# EAGLE board LinkIt ONE_v1.0 (EAGLE 6.4), part 1 of 3
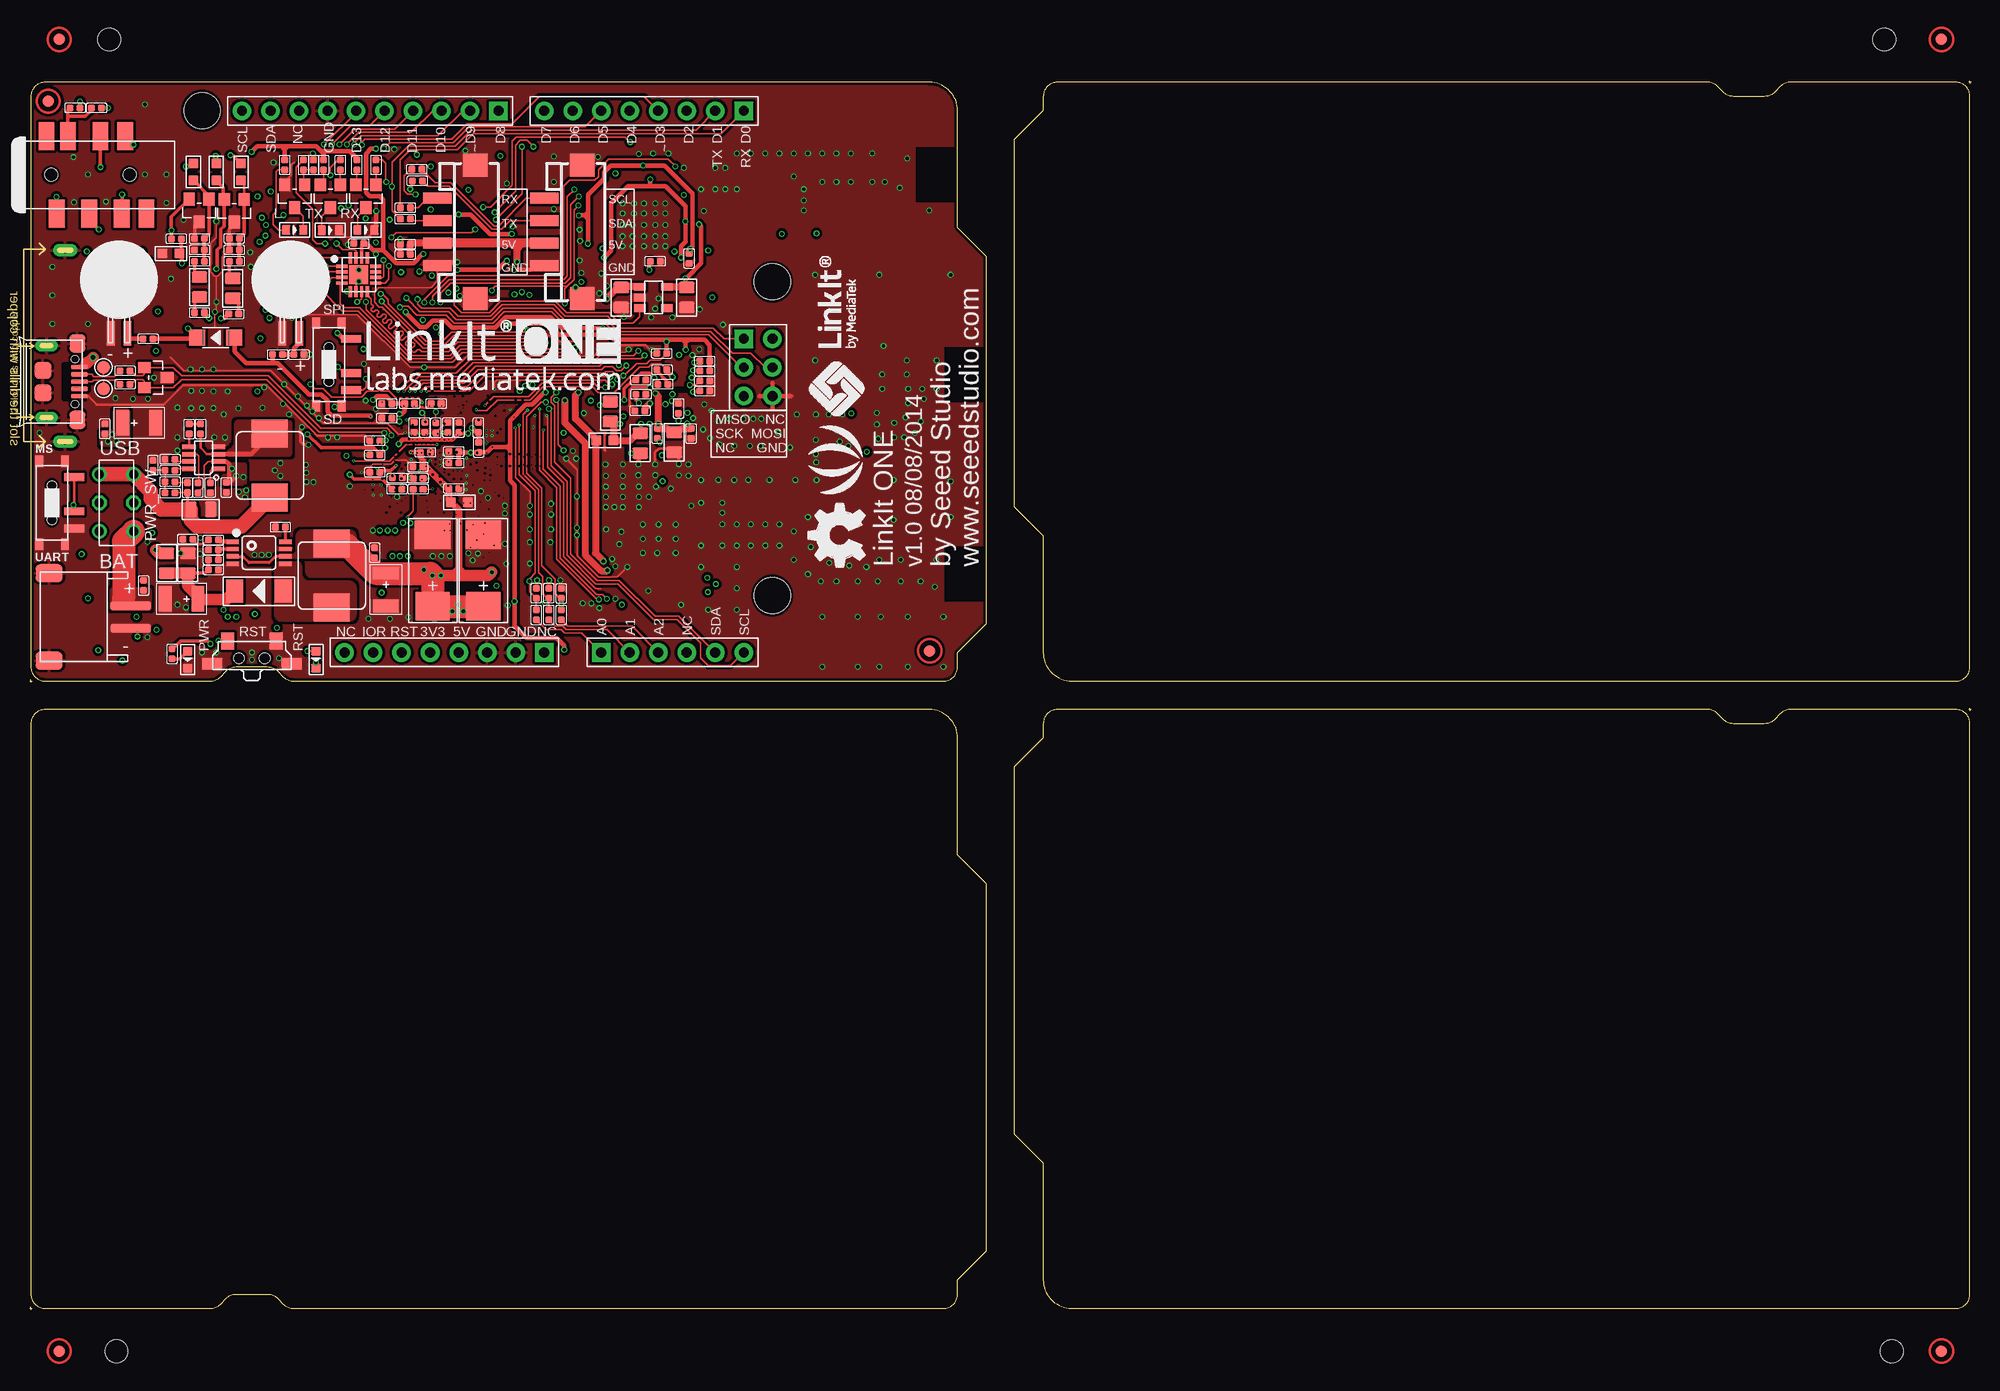
[diagram p9: board, top side]
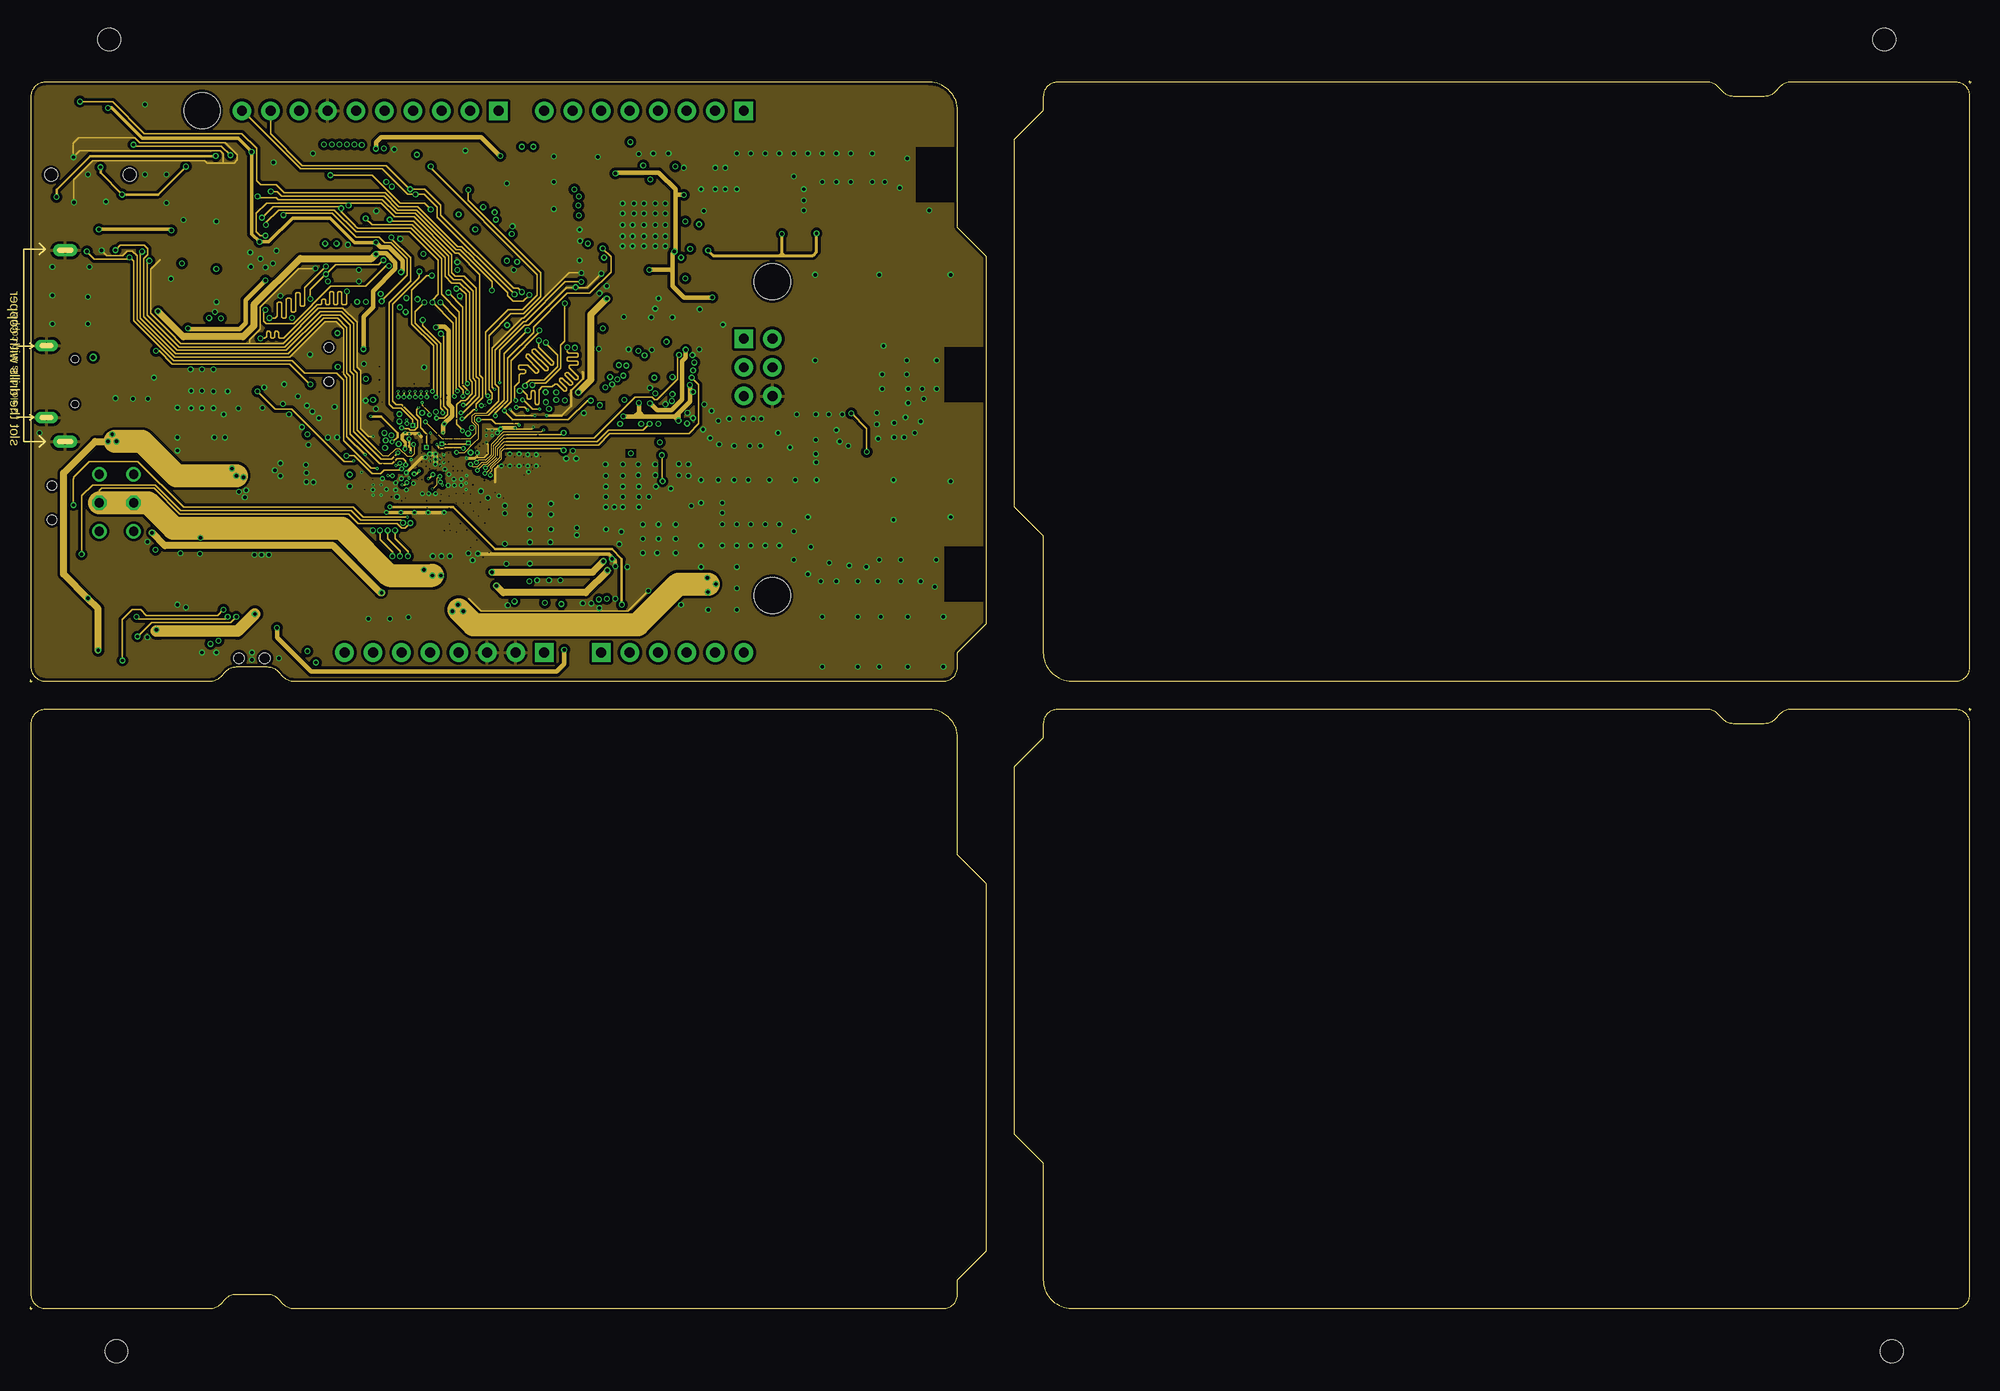
[diagram p10: board, inner layer GND]
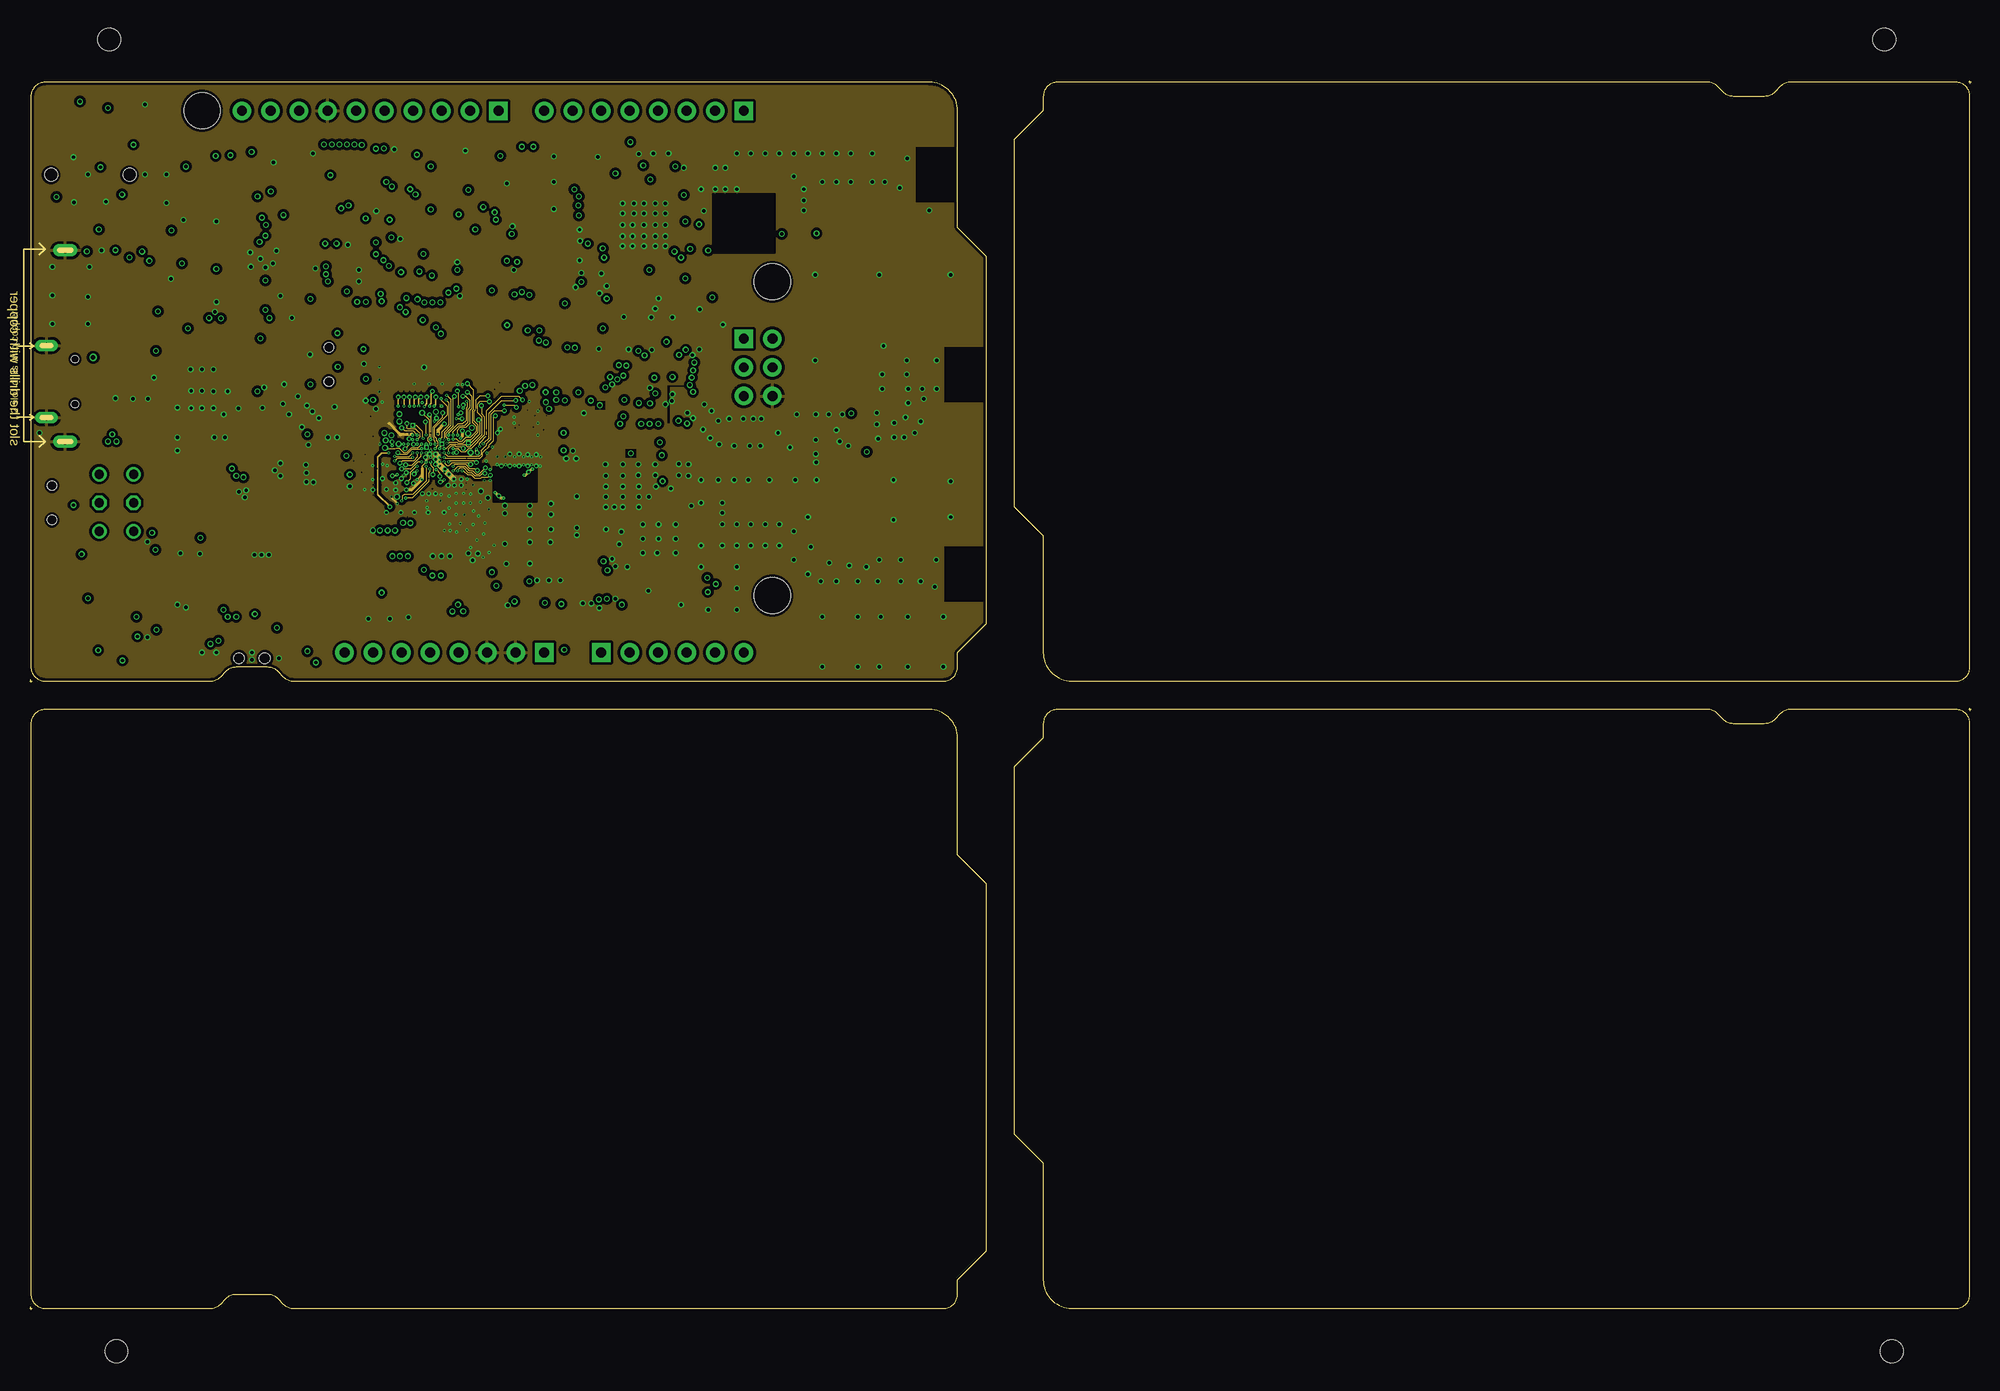
[diagram p11: board, inner layer GND1]
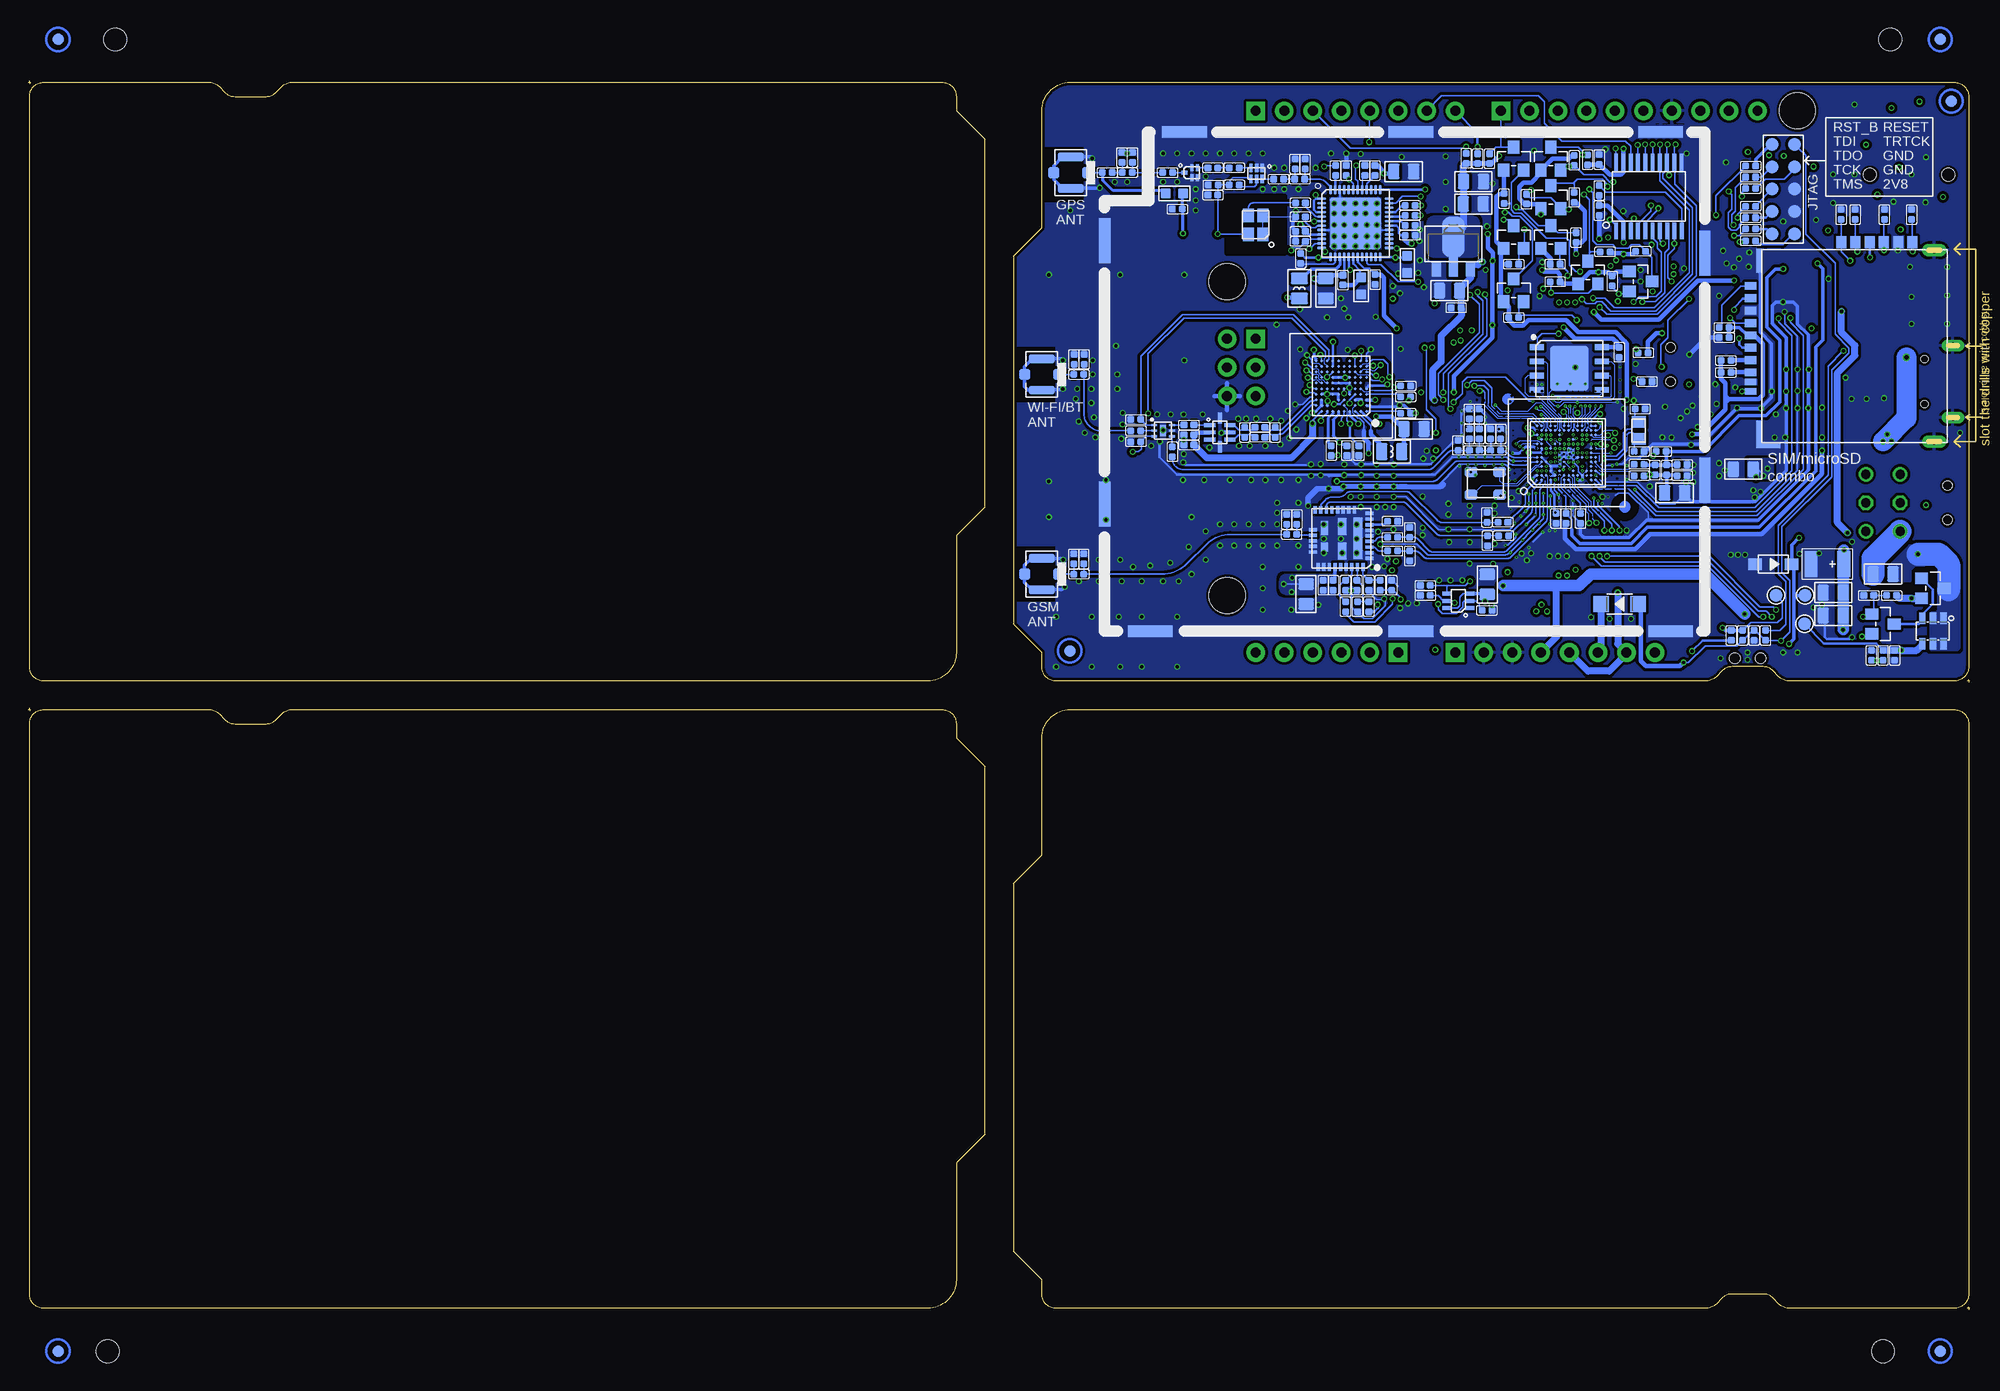
[diagram p12: board, bottom side, seen from below]

Size 172.97 x 109.47 mm. Coordinates in mm from the lower left corner, seen from the top.
Outline: 0,56.01 0.13,56.01
Outline: 0.13,56.01 0.25,56.01
Outline: 0.13,56.01 0.13,56.13
Outline: 0.13,56.01 0.13,55.88
Outline: 0,0.13 0.13,0.13
Outline: 0.13,0.13 0.25,0.13
Outline: 0.13,0.13 0.13,0.25
Outline: 0.13,0.13 0.13,0
Outline: 172.97,109.35 172.85,109.35
Outline: 172.85,109.35 172.72,109.35
Outline: 172.85,109.35 172.85,109.22
Outline: 172.85,109.35 172.85,109.47
Outline: 172.97,53.47 172.85,53.47
Outline: 172.85,53.47 172.72,53.47
Outline: 172.85,53.47 172.85,53.34
Outline: 172.85,53.47 172.85,53.59
Outline: 82.68,96.39 82.68,106.81 arc90 80.14,109.35 1.4,109.35 arc90 0.13,108.08 0.13,57.28 arc90 1.4,56.01 16.11,56.01 arc45 17.01,56.38 17.54,56.91 arc-45 18.43,57.28 21.19,57.28 arc-45 22.09,56.91 22.61,56.38 arc45 23.51,56.01 81.41,56.01 arc90 82.68,57.28 82.68,58.55 85.22,61.09 85.22,93.85 82.68,96.39
Outline: 82.68,40.51 82.68,50.93 arc90 80.14,53.47 1.4,53.47 arc90 0.13,52.2 0.13,1.4 arc90 1.4,0.13 16.11,0.13 arc45 17.01,0.5 17.54,1.02 arc-45 18.43,1.4 21.19,1.4 arc-45 22.09,1.02 22.61,0.5 arc45 23.51,0.13 81.41,0.13 arc90 82.68,1.4 82.68,2.67 85.22,5.21 85.22,37.97 82.68,40.51
Outline: 90.3,68.96 90.3,58.55 arc90 92.84,56.01 171.58,56.01 arc90 172.85,57.28 172.85,108.08 arc90 171.58,109.35 156.86,109.35 arc45 155.97,108.97 155.44,108.45 arc-45 154.54,108.08 151.78,108.08 arc-45 150.89,108.45 150.36,108.97 arc45 149.46,109.35 91.57,109.35 arc90 90.3,108.08 90.3,106.81 87.76,104.27 87.76,71.5 90.3,68.96
Outline: 90.3,13.08 90.3,2.67 arc90 92.84,0.13 171.58,0.13 arc90 172.85,1.4 172.85,52.2 arc90 171.58,53.47 156.86,53.47 arc45 155.97,53.09 155.44,52.57 arc-45 154.54,52.2 151.78,52.2 arc-45 150.89,52.57 150.36,53.09 arc45 149.46,53.47 91.57,53.47 arc90 90.3,52.2 90.3,50.93 87.76,48.39 87.76,15.62 90.3,13.08
Copper layers [2:(1+(2*15)+16):15]: Top 0.035mm / dielectric 0.2mm / GND 0.0175mm / dielectric 0.7mm / GND1 0.0175mm / dielectric 0.2mm / Bottom 0.035mm
Design rules "default *": minimum track width 3mil, minimum drill 4mil, track to track 3mil, track to pad 3mil, pad to pad 3mil, via to via 3mil, smd to smd 0mil, copper to edge 10mil, drill to drill 8mil, minimum pad ring 2mil, minimum via ring 2mil, stop-mask expansion 2mil, vias tented up to drill 25mil, thermal gap 10mil
Net classes: 0 default: width 0.076 mm, drill 0.102 mm, clearance 0.076 mm
Holes 2.03 mm at 7.11,113.16 165.23,113.16 165.86,-3.68 7.75,-3.68
tRestrict: area 53.2,75.8 to 55.1,76.8; area 56.4,80.4 to 56.9,80.9; area 57,81.3 to 57.5,81.8; area 58.4,79.6 to 58.9,80.1; area 50.5,80.4 to 52.5,81.4; area 65.4,80.6 to 67,82.2; 4 lines
bRestrict: area 61.1,94.1 to 66.2,99.2; area 41.4,72.1 to 45,75.1; area 53,75.8 to 54,76.8; area 57,81.3 to 57.5,81.8; area 55.8,80.3 to 58,81.8; area 65.4,80.6 to 67,82.2; 4 lines

## Footprints (pad centres in the part's own frame; a part is rotated, then mirrored left to right if it is on the bottom)
C0805 = smd 1.016 x 1.397: 1 -0.889,0; 2 0.889,0
C0402 = smd 0.635 x 0.635: 1 -0.445,0; 2 0.445,0
AVX-D = smd 2.54 x 3.048: + -3.175,0 | smd 2.54 x 3.175: - 3.175,0
C0603 = smd 0.889 x 0.889: 1 -0.762,0; 2 0.762,0
AVX-B = smd 1.143 x 2.286: + -1.46,0; - 1.46,0
2P-D6.8MMX1.8MMH = smd 2.2 x 0.7: + 4.8,0.75; - 4.8,-0.75
SOD123 = smd 1.397 x 1.397: + -1.651,0; - 1.651,0
SOD123-2.7X1.6 = smd 1.2 x 1.02: 1 -1.635,0; 2 1.635,0
SOT23 = smd 1.016 x 1.143: 1 -0.889,-1.016; 2 0.889,-1.016; 3 0,1.016
D2010 = smd 1.524 x 2.032: + -2.159,0; - 2.159,0
TP_4545 = smd 1.143 x 1.143: T 0,0
4P-U-FL = smd 1.016 x 1.016: D -1.524,0; GND3 1.524,0 | smd 2.286 x 0.762: GND1 0,1.397; GND2 0,-1.397
4P-SMD-2.0 = smd 0.965 x 2.54: 1 -3,0; 2 -1,0; 3 1,0; 4 3,0 | smd 2.032 x 2.184: SS1 -5.946,3.4; SS2 5.946,3.4
JST-SMD-2.0-90D = smd 1.6 x 2.4: 3 3.9,-2.181; 4 -3.9,-2.181 | smd 0.8 x 3.6: + -1,5.08; - 1,5.08
16P-L17.4MM*W16.5MM*H2.7MM = smd 0.7 x 1: 1 -2.35,9.25; 2 -1.25,9.25; 3 -0.15,9.25; 4 0.95,9.25; 5 2.05,9.25; 6 3.15,9.25; 7 4.25,9.25; 8 5.35,9.25 | smd 1.1 x 0.9: C1 9.25,-5.16; C2 9.25,-2.62; C3 9.25,-0.08; C5 9.25,-3.89; C6 9.25,-1.35; C7 9.25,1.19 | drill 0.5 pad 1.1 long: P1 -8.525,-7.1; P2 8.525,-7.1 | smd 0.5 x 1.65: P3 -8.85,7.425 | smd 2.45 x 0.5: P4 -7.875,8.5 | smd 2.13 x 0.5: P5 7.585,8.5 | smd 0.6 x 1: SA -4.05,9.25; SB -3.2,9.25
MICRO-USB = smd 0.381 x 1.524: 1 -1.3,-0.25; 2 -0.65,-0.25; 3 0,-0.25; 4 0.65,-0.25; 5 1.3,-0.25 | smd 1.6 x 1.397: S1 -3.4,-0.427; S6 3.4,-0.427 | drill 0.508 pad 1.016 long: S2 -3.226,-3.175; S5 3.226,-3.175 | smd 1.5 x 1.5: S3 -1,-3.5; S4 1,-3.5 | hole 0.635: -2,-0.65; 2,-0.65
8P-3.5-SMD = smd 1.4 x 2.5: 1 2.8,-3.45; 2 5.7,-3.45; 3 8.6,-3.45; 4 8.9,3.45; 5 1.9,3.45; 6 3.8,3.45; 7 6.7,3.45; 8 10.8,-3.45 | hole 1.149: 2.3,0; 9.3,0
2*5P-2.0-TESTPOINT = smd 1.143 x 1.143: 1 -1,4; 2 -1,2; 3 -1,0; 4 -1,-2; 5 -1,-4; 6 1,-4; 7 1,-2; 8 1,0; 9 1,2; 10 1,4
LED-0603 = smd 0.762 x 0.889: + -0.762,0; - 0.762,0
L0402 = smd 0.635 x 0.635: 1 -0.445,0; 2 0.445,0
L0603 = smd 0.889 x 0.889: 1 -0.762,0; 2 0.762,0
0806 = smd 1.016 x 1.524: 1 -0.889,0; 2 0.889,0
L0630 = smd 2.5 x 3.2: 1 -2.85,0; 2 2.85,0
L0805 = smd 1.016 x 1.397: 1 -0.889,0; 2 0.889,0
ROUND-MARK-1.0 = smd 1.016 x 1.016: P$1 0,0
R0402 = smd 0.635 x 0.635: 1 -0.445,0; 2 0.445,0
R0805 = smd 1.016 x 1.397: 1 -0.889,0; 2 0.889,0
4P-SMD-7X3.5X3.5H = smd 1.143 x 1.524: 1 -2.159,1.524; 2 2.159,1.524 | smd 1.778 x 1.016: S1 -3.556,-0.508; S2 3.556,-0.508 | hole 0.95: -1.15,0; 1.15,0
3P-SMD-2CH-6.6X2.8-REINFORCE = smd 1.8 x 0.7: A 1.978,2.286; B 1.978,-2.286; COM 1.978,-0.762 | smd 0.7 x 1.016: SS1 -1.15,-3.683; SS2 1.15,-3.683; SS3 1.15,3.683; SS4 -1.15,3.683 | hole 0.813: 0,-1.524; 0,1.524
6P-2CH-2.54-7.6X3.0 = drill 0.813 pad 1.27: CH1A -1.524,2.54; CH1B -1.524,-2.54; CH2A 1.524,2.54; CH2B 1.524,-2.54 | drill 0.813 pad 1.27 octagon: COM1 -1.524,0; COM2 1.524,0
TFBGA84 = smd 0.25 x 0.25: A1 -2.25,2.25; A2 -1.75,2.25; A3 -1.25,2.25; A4 -0.75,2.25; A5 -0.25,2.25; A6 0.25,2.25; A7 0.75,2.25; A8 1.25,2.25; A9 1.75,2.25; A10 2.25,2.25; B1 -2.25,1.75; B3 -1.25,1.75; B5 -0.25,1.75; B8 1.25,1.75; B9 1.75,1.75; B10 2.25,1.75; C1 -2.25,1.25; C2 -1.75,1.25; C3 -1.25,1.25; C5 -0.25,1.25; C6 0.25,1.25; C9 1.75,1.25; C10 2.25,1.25; D1 -2.25,0.75; D2 -1.75,0.75; D3 -1.25,0.75; D4 -0.75,0.75; D6 0.25,0.75; D7 0.75,0.75; D9 1.75,0.75; D10 2.25,0.75; E1 -2.25,0.25; E2 -1.75,0.25; E3 -1.25,0.25; E5 -0.25,0.25; E6 0.25,0.25; E7 0.75,0.25; E8 1.25,0.25; E9 1.75,0.25; E10 2.25,0.25; F2 -1.75,-0.25; F3 -1.25,-0.25; F4 -0.75,-0.25; F6 0.25,-0.25; F7 0.75,-0.25; F8 1.25,-0.25; F9 1.75,-0.25; F10 2.25,-0.25; G1 -2.25,-0.75; G2 -1.75,-0.75; G3 -1.25,-0.75; G4 -0.75,-0.75; G6 0.25,-0.75; G7 0.75,-0.75; G9 1.75,-0.75; G10 2.25,-0.75; H1 -2.25,-1.25; H2 -1.75,-1.25; H3 -1.25,-1.25; H4 -0.75,-1.25; H5 -0.25,-1.25; H6 0.25,-1.25; H7 0.75,-1.25; H8 1.25,-1.25; H9 1.75,-1.25; H10 2.25,-1.25; J1 -2.25,-1.75; J2 -1.75,-1.75; J3 -1.25,-1.75; J4 -0.75,-1.75; J5 -0.25,-1.75; J6 0.25,-1.75; J7 0.75,-1.75; J8 1.25,-1.75; J9 1.75,-1.75; J10 2.25,-1.75; K1 -2.25,-2.25; K2 -1.75,-2.25; K4 -0.75,-2.25; K6 0.25,-2.25; K7 0.75,-2.25; K8 1.25,-2.25; K9 1.75,-2.25; K10 2.25,-2.25
QFN48-6X6MM = smd 0.25 x 0.8: 1 -2.2,-3; 2 -1.8,-3; 3 -1.4,-3; 4 -1,-3; 5 -0.6,-3; 6 -0.2,-3; 7 0.2,-3; 8 0.6,-3; 9 1,-3; 10 1.4,-3; 11 1.8,-3; 12 2.2,-3; 25 2.2,3; 26 1.8,3; 27 1.4,3; 28 1,3; 29 0.6,3; 30 0.2,3; 31 -0.2,3; 32 -0.6,3; 33 -1,3; 34 -1.4,3; 35 -1.8,3; 36 -2.2,3 | smd 0.8 x 0.25: 13 3,-2.2; 14 3,-1.8; 15 3,-1.4; 16 3,-1; 17 3,-0.6; 18 3,-0.2; 19 3,0.2; 20 3,0.6; 21 3,1; 22 3,1.4; 23 3,1.8; 24 3,2.2; 37 -3,2.2; 38 -3,1.8; 39 -3,1.4; 40 -3,1; 41 -3,0.6; 42 -3,0.2; 43 -3,-0.2; 44 -3,-0.6; 45 -3,-1; 46 -3,-1.4; 47 -3,-1.8; 48 -3,-2.2 | smd 4.6 x 4.6: PAD 0,0
WSON8-6X5X0.8H-W/HEAT = smd 0.5 x 1.25: 1 -1.905,-2.875; 2 -0.635,-2.875; 3 0.635,-2.875; 4 1.905,-2.875; 5 1.905,2.875; 6 0.635,2.875; 7 -0.635,2.875; 8 -1.905,2.875 | smd 4 x 3.4: PAD 0,0
SOT-25J = smd 0.7 x 1: 1 -0.95,-1.2; 2 0,-1.2; 3 0.95,-1.2; 4 0.95,1.2; 5 -0.95,1.2
TQFN16 = smd 1 x 0.3: 1 -1.5,0.75; 2 -1.5,0.25; 3 -1.5,-0.25; 4 -1.5,-0.75; 9 1.5,-0.75; 10 1.5,-0.25; 11 1.5,0.25; 12 1.5,0.75 | smd 0.3 x 1: 5 -0.75,-1.5; 6 -0.25,-1.5; 7 0.25,-1.5; 8 0.75,-1.5; 13 0.75,1.5; 14 0.25,1.5; 15 -0.25,1.5; 16 -0.75,1.5 | smd 1.7 x 1.7: PAD 0,0
VFBGA143 = smd 0.25 x 0.25: A1 -2.4,2.6; A2 -2,2.6; A3 -1.6,2.6; A5 -0.8,2.6; A6 -0.4,2.6; A8 0.4,2.6; A9 0.8,2.6; A11 1.6,2.6; A12 2,2.6; A13 2.4,2.6; B1 -2.4,2.2; B2 -2,2.2; B3 -1.6,2.2; B4 -1.2,2.2; B5 -0.8,2.2; B6 -0.4,2.2; B7 0,2.2; B8 0.4,2.2; B9 0.8,2.2; B10 1.2,2.2; B11 1.6,2.2; B12 2,2.2; B13 2.4,2.2; C2 -2,1.8; C3 -1.6,1.8; C4 -1.2,1.8; C5 -0.8,1.8; C7 0,1.8; C8 0.4,1.8; C11 1.6,1.8; C12 2,1.8; D1 -2.4,1.4; D2 -2,1.4; D3 -1.6,1.4; D4 -1.2,1.4; D5 -0.8,1.4; D7 0,1.4; D8 0.4,1.4; D10 1.2,1.4; D11 1.6,1.4; D12 2,1.4; D13 2.4,1.4; E1 -2.4,1; E2 -2,1; E5 -0.8,1; E6 -0.4,1; E7 0,1; E8 0.4,1; E9 0.8,1; E12 2,1; E13 2.4,1; F2 -2,0.6; F3 -1.6,0.6; F4 -1.2,0.6; F5 -0.8,0.6; F6 -0.4,0.6; F7 0,0.6; F8 0.4,0.6; F9 0.8,0.6; F10 1.2,0.6; F11 1.6,0.6; F12 2,0.6; G1 -2.4,0.2; G2 -2,0.2; G4 -1.2,0.2; G5 -0.8,0.2; G6 -0.4,0.2; G7 0,0.2; G8 0.4,0.2; G9 0.8,0.2; G12 2,0.2; G13 2.4,0.2; H1 -2.4,-0.2; H2 -2,-0.2; H5 -0.8,-0.2; H6 -0.4,-0.2; H7 0,-0.2; H8 0.4,-0.2; H9 0.8,-0.2; H10 1.2,-0.2; H12 2,-0.2; H13 2.4,-0.2; J2 -2,-0.6; J3 -1.6,-0.6; J4 -1.2,-0.6; J5 -0.8,-0.6; J6 -0.4,-0.6; J7 0,-0.6; J8 0.4,-0.6; J9 0.8,-0.6; J10 1.2,-0.6; J11 1.6,-0.6; J12 2,-0.6; K1 -2.4,-1; K2 -2,-1; K5 -0.8,-1; K6 -0.4,-1; K7 0,-1; K8 0.4,-1; K9 0.8,-1; K12 2,-1; K13 2.4,-1; L1 -2.4,-1.4; L2 -2,-1.4; L3 -1.6,-1.4; L4 -1.2,-1.4; L6 -0.4,-1.4; L7 0,-1.4; L9 0.8,-1.4; L10 1.2,-1.4; L11 1.6,-1.4; L12 2,-1.4; L13 2.4,-1.4; M2 -2,-1.8; M3 -1.6,-1.8; M6 -0.4,-1.8; M7 0,-1.8; M10 1.2,-1.8; M11 1.6,-1.8; M12 2,-1.8; N1 -2.4,-2.2; N2 -2,-2.2; N3 -1.6,-2.2; N4 -1.2,-2.2; N5 -0.8,-2.2; N6 -0.4,-2.2; N7 0,-2.2; N8 0.4,-2.2; N9 0.8,-2.2; N10 1.2,-2.2; N11 1.6,-2.2; N12 2,-2.2; N13 2.4,-2.2; P1 -2.4,-2.6; P2 -2,-2.6; P3 -1.6,-2.6; P5 -0.8,-2.6; P6 -0.4,-2.6; P8 0.4,-2.6; P9 0.8,-2.6; P11 1.6,-2.6; P12 2,-2.6; P13 2.4,-2.6
SOT23-6L = smd 0.55 x 1.016: 1 -0.95,-1.143; 2 0,-1.143; 3 0.95,-1.143; 4 0.95,1.143; 5 0,1.143; 6 -0.95,1.143
5P-SMD-1.4X1.1MM = smd 0.55 x 0.326: 1 -0.65,0 | smd 0.25 x 0.625: 2 0,-0.438; 3 0.5,-0.438; 4 0.5,0.438; 5 0,0.438
SHIELD-SMD-44.5X53.5 = smd 4 x 1.016: 1 3.937,0; 4 49.403,44.45; 5 46.355,0; 6 3.048,44.45; 9 26.162,44.45; 10 26.162,0 | smd 1.016 x 4: 2 0,30.988; 3 53.467,9.652; 7 53.467,33.147; 8 0,10.795
ARDUINO-38P = drill 0.889 pad 1.651 square: 1 63.5,50.8; 9 41.656,50.8; 19 50.8,2.54; 25 45.72,2.54; 38 63.5,30.48 | drill 0.889 pad 1.651: 2 60.96,50.8; 3 58.42,50.8; 4 55.88,50.8; 5 53.34,50.8; 6 50.8,50.8; 7 48.26,50.8; 8 45.72,50.8; 10 39.116,50.8; 11 36.576,50.8; 12 34.036,50.8; 13 31.496,50.8; 14 28.956,50.8; 15 26.416,50.8; 16 23.876,50.8; 17 21.336,50.8; 18 18.796,50.8; 20 53.34,2.54; 21 55.88,2.54; 22 58.42,2.54; 23 60.96,2.54; 24 63.5,2.54; 26 43.18,2.54; 27 40.64,2.54; 28 38.1,2.54; 29 35.56,2.54; 30 33.02,2.54; 31 30.48,2.54; 32 27.94,2.54; 33 66.04,30.48; 34 66.04,27.94; 35 66.04,25.4; 36 63.5,25.4; 37 63.5,27.94 | hole 3.2: 15.24,50.8; 66.04,35.56; 66.04,7.62
TSOT23-8 = smd 0.4 x 1.2: 1 -0.975,-1.3; 2 -0.325,-1.3; 3 0.325,-1.3; 4 0.975,-1.3; 5 0.975,1.3; 6 0.325,1.3; 7 -0.325,1.3; 8 -0.975,1.3
6P-SMD-1.5X1.0X0.72H = smd 0.3 x 0.75: 1 -0.5,-0.5; 2 0,-0.5; 3 0.5,-0.5; 4 0.5,0.5; 5 0,0.5; 6 -0.5,0.5
32P-SMD-RF1798-5.3MMX5.25MMX0.73H = smd 0.7 x 0.3: 1 -2.525,1.77; 2 -2.525,1.27; 3 -2.525,0.77; 4 -2.525,0.27; 5 -2.525,-0.23; 6 -2.525,-0.73; 7 -2.525,-1.23; 8 -2.525,-1.73; 9 -2.525,-2.23; 18 2.525,-0.785; 19 2.525,-0.285; 20 2.525,0.215; 21 2.525,0.715; 22 2.525,1.215 | smd 0.3 x 0.7: 10 -1.175,-2.55; 11 -0.675,-2.55; 12 -0.175,-2.55; 13 0.325,-2.55; 14 0.825,-2.55; 15 1.325,-2.55; 16 1.825,-2.55; 17 2.325,-2.55; 23 2.055,2.55; 24 1.555,2.55; 25 1.055,2.55; 26 0.555,2.55; 27 0.055,2.55; 28 -0.445,2.55; 29 -0.945,2.55; 30 -1.445,2.55; 31 -1.945,2.55 | smd 0.805 x 3.715: 32 -1.473,0 | smd 0.785 x 1.535: 33 -0.083,1.133; 34 -0.083,-1.055 | smd 0.635 x 0.8: 35 1.493,0.765 | smd 0.635 x 1.245: 36 1.493,-0.933
8P-SMD-2X1.25X0.7H = smd 0.35 x 1: 1 0.65,0.9; 2 0,0.9; 3 -0.65,0.9; 5 -0.65,-0.9; 6 0,-0.9; 7 0.65,-0.9 | smd 1 x 0.35: 4 -1.281,0; 8 1.281,0
TSON6 = smd 0.5 x 0.2: 1 -0.8,0.5; 2 -0.8,0; 3 -0.8,-0.5; 4 0.8,-0.5; 5 0.8,0; 6 0.8,0.5 | smd 0.5 x 1: PAD 0,0
SOT363 = smd 0.35 x 0.8: 1 -0.65,-1.025; 2 0,-1.025; 3 0.65,-1.025; 4 0.65,1.025; 5 0,1.025; 6 -0.65,1.025
TSSOP20 = smd 0.35 x 1.5: 1 -2.925,-3.065; 2 -2.275,-3.065; 3 -1.625,-3.065; 4 -0.975,-3.065; 5 -0.325,-3.065; 6 0.325,-3.065; 7 0.975,-3.065; 8 1.625,-3.065; 9 2.275,-3.065; 10 2.925,-3.065; 11 2.91,3.065; 12 2.26,3.065; 13 1.61,3.065; 14 0.96,3.065; 15 0.325,3.065; 16 -0.325,3.065; 17 -0.975,3.065; 18 -1.625,3.065; 19 -2.275,3.065; 20 -2.925,3.065
SOT89 = smd 0.8 x 1.4: 1 -1.524,-1.905; 3 1.524,-1.905 | smd 0.8 x 1.9: 2 0,-1.651 | smd 2.032 x 3.65: 4 0,0.94
MSOP8 = smd 0.4 x 1.1: 1 -0.975,-2.35; 2 -0.325,-2.35; 3 0.325,-2.35; 4 0.975,-2.35; 5 0.975,2.35; 6 0.325,2.35; 7 -0.325,2.35; 8 -0.975,2.35
2P-SMD-2.05X1.2 = smd 1 x 1.25: 1 -0.75,0; 2 0.75,0
2520 = smd 1.2 x 1: 1 -0.85,-0.65; 2 0.85,-0.65; 3 0.85,0.65; 4 -0.85,0.65
4P-SMD-3.2X2.5 = smd 1.143 x 0.889: 1 -1.27,-1.016; 2 1.27,-1.016; 3 1.27,1.016; 4 -1.27,1.016

## Placement (x,y rotation side)
C1  4.7uF  [C0805]  46.36,90.78 180 bottom
C2  4.7uF  [C0805]  44.22,100.51 0 bottom
C3  100nF  [C0402]  30.73,67.44 90 top
C4  100nF  [C0402]  16.38,65.91 0 top
C5  100nF  [C0402]  33.02,97.92 270 bottom
C6  1uF  [C0402]  50.27,79.86 0 bottom
C7  100nF  [C0402]  33.02,102.46 90 bottom
C8  1uF  [C0402]  37.8,73.15 0 top
C9  1uF  [C0402]  36.2,78.56 270 top
C10  1uF  [C0402]  31.83,79.43 180 top
C11  4.7uF  [C0805]  49.53,78.46 0 bottom
C12  4.7uF  [C0805]  54.41,77.19 270 top
C13  1uF  [C0402]  54.47,81.55 180 top
C14  100nF  [C0402]  54.38,80.09 0 top
C15  1uF  [C0402]  55.5,76.53 270 bottom
C16  1uF  [C0402]  60.15,82.73 180 top
C17  18pF  [C0402]  60.15,81.84 180 top
C18  100nF  [C0402]  58.93,78.05 90 top
C19  100nF  [C0402]  57.81,80.29 270 top
C20  1nF  [C0402]  56.9,76.53 90 bottom
C21  100nF  [C0402]  56.41,82.45 0 top
C22  1uF  [C0402]  54.44,82.83 0 top
C23  1uF  [C0402]  56.31,85.19 180 top
C24  18pF  [C0402]  71.48,101.3 180 bottom
C25  18pF  [C0402]  67.44,101.73 0 bottom
C26  1uF  [C0402]  59.64,95.17 180 bottom
C27  DNP/18pF  [C0402]  75.54,102.64 90 bottom
C28  100nF  [C0402]  33.48,94.92 180 top
C29  1uF  [C0402]  52.98,91.77 270 bottom
C30  SMD CAP Tantalum 470uF-6.3V;D  [AVX-D]  35.92,65.84 90 top
C31  220nF  [C0402]  55.85,91.72 90 bottom
C32  22uF  [C0805]  44.25,98.5 0 bottom
C33  SMD CAP Tantalum 470uF-6.3V;D  [AVX-D]  40.44,65.84 90 top
C34  4.7uF  [C0805]  50.44,101.4 0 bottom
C35  4.7uF  [C0805]  57.38,90.98 270 bottom
C36  1uF  [C0402]  58.75,93.65 270 top
C37  1uF  [C0402]  59.61,93.65 270 bottom
C38  1uF  [C0402]  59.64,97.36 180 bottom
C39  1uF  [C0402]  59.64,96.06 180 bottom
C40  100nF  [C0402]  49.89,95.71 0 bottom
C41  2.2uF  [C0603]  50.11,93.12 270 bottom
C42  DNP/100nF  [C0402]  55.55,101.47 90 bottom
C43  1nF  [C0402]  59.64,98.6 180 bottom
C44  100nF  [C0402]  55.73,93.4 0 top
C45  4.7uF  [C0805]  52.71,90.17 270 top
C46  4.7uF  [C0805]  58.55,90.17 270 top
C47  1uF  [C0402]  37.26,78.59 90 top
C48  1uF  [C0402]  9.02,63.63 180 bottom
C49  SMD CAP Tantalum 47uF-10V;B  [AVX-B]  9.78,78.99 0 top
C50  SMD CAP Tantalum 47uF-10V;B  [AVX-B]  31.75,64.16 270 top
C51  22uF  [C0805]  18.11,90.98 90 top
C52  22uF  [C0805]  15.14,91.11 90 top
C53  390pF  [C0402]  15.14,94.41 180 top
C54  390pF  [C0402]  18.24,94.41 180 top
C55  100nF  [C0402]  29.46,74.3 0 bottom
C56  33pF  [C0402]  25.63,75.29 0 bottom
C57  33pF  [C0402]  25.63,74.3 0 bottom
C58  100nF  [C0402]  29.46,75.31 0 bottom
C59  100pF  [C0402]  28.07,74.8 270 bottom
C60  4.7uF  [C0805]  26.31,72.77 0 bottom
C61  27pF  [C0402]  7.62,97.56 90 bottom
C62  27pF  [C0402]  10.24,97.56 90 bottom
C63  1uF  [C0402]  37.8,76.45 180 top
C64  27pF  [C0402]  11.48,97.56 90 bottom
C65  1uF  [C0402]  5.21,97.56 90 bottom
C66  100nF  [C0402]  21.89,86.61 180 bottom
C67  1.2pF  [C0402]  59.69,100.71 0 bottom
C68  DNP/18pF  [C0402]  60.12,102.06 90 bottom
C69  1uF  [C0402]  38.25,78.59 90 top
C70  1uF  [C0402]  31.83,80.72 180 top
C71  1uF  [C0402]  37.8,75.44 180 top
C72  1uF  [C0402]  35.26,76.38 0 top
C73  2.2uF  [C0603]  38.3,71.93 0 top
C74  22uF  [C0805]  20.19,74.87 180 bottom
C75  22pF  [C0402]  29.39,80.24 0 bottom
C76  22pF  [C0402]  29.46,76.45 0 bottom
C77  100nF  [C0402]  12.52,75.77 180 top
C78  15pF  [C0402]  14.08,73.24 270 top
C79  22uF  [C0805]  15.27,71.3 0 top
C80  18pF  [C0402]  70.61,98.04 180 bottom
C81  330pF  [C0402]  19.23,60.07 270 bottom
C82  DNP/18pF  [C0402]  59.97,70.41 90 bottom
C83  DNP/18pF  [C0402]  60.86,70.41 90 bottom
C84  1.2pF  [C0402]  79.81,84.66 90 bottom
C85  18pF  [C0402]  76.83,101.3 180 bottom
C87  100nF  [C0402]  29.34,94.97 180 top
C88  SMD CAP Tantalum 47uF-10V;B  [AVX-B]  13.54,63.32 180 top
C89  DNP/22pF  [C0402]  47.37,63.8 90 top
C90  100nF  [C0402]  33.48,94.01 180 top
C91  1uF  [C0402]  31.24,85.29 270 bottom
C92  1uF  [C0402]  34.7,70.48 270 bottom
C93  1uF  [C0402]  24,85.09 0 top
C94  1uF  [C0402]  32.77,74.09 0 top
C95  1uF  [C0402]  30.76,76.15 180 top
C96  1uF  [C0402]  30.76,77.42 180 top
C97  100nF  [C0402]  30.76,74.6 180 top
C98  1uF  [C0402]  6.71,78.49 90 top
C99  2.2uF  [C0603]  54.23,91.21 270 bottom
C100  22nF  [C0402]  16.1,73.23 270 top
C101  100nF  [C0402]  34.59,75.08 180 top
C102  DNP/22pF  [C0402]  46.25,63.83 90 top
C103  DNP/22pF  [C0402]  48.51,64.52 180 bottom
C104  1uF  [C0402]  36.88,70.48 270 bottom
C105  100nF  [C0402]  15.24,78.46 90 top
C106  100nF  [C0402]  17.53,73.25 270 top
C107  DNP/EECENOF204Rk  [2P-D6.8MMX1.8MMH]  23.27,91.77 270 top
C108  100nF  [C0402]  45.77,89.26 180 bottom
C109  1uF  [C0402]  10.16,64.52 90 top
C110  1.2pF  [C0402]  45.61,77 90 bottom
C111  1.5pF  [C0402]  44.59,78.02 90 bottom
C112  1.8pF  [C0402]  43.7,79.79 90 bottom
C113  1.5pF  [C0402]  42.68,78.02 90 bottom
C114  0.5pF  [C0402]  41.8,78.02 90 bottom
C115  1.2pF  [C0402]  78.92,84.66 90 bottom
C116  1uF  [C0402]  6.71,58.29 270 bottom
C117  DNP/0.5pF  [C0402]  74.6,102.64 90 bottom
C118  18pF  [C0402]  61.6,100.71 0 bottom
C119  33nF  [C0402]  67.41,100.19 180 bottom
C120  1uF  [C0402]  67.44,99.3 180 bottom
C122  DNP/4.7uF  [C0805]  43,64.62 90 bottom
C124  DNP/18pF  [C0402]  79.83,66.88 90 bottom
C125  DNP/18pF  [C0402]  78.94,66.88 90 bottom
C126  39pF  [C0402]  57.61,64.54 90 bottom
C127  100nF  [C0402]  56.72,64.54 90 bottom
C128  22uF  [C0805]  59.13,63.75 90 bottom
C129  39pF  [C0402]  55.63,64.54 270 bottom
C130  39pF  [C0402]  53.54,64.54 270 bottom
C131  220pF  [C0402]  54.61,64.54 270 bottom
C132  1pF  [C0402]  43.03,70.59 90 bottom
C133  DNP/2.7pF  [C0402]  42.98,68.5 270 bottom
C134  2.2pF  [C0402]  49.91,67.14 270 bottom
C135  2.2pF  [C0402]  49.91,69.25 90 bottom
C136  1.5nF  [C0402]  51.44,70.24 0 bottom
C137  18pF  [C0402]  74.3,78.31 0 bottom
C138  18pF  [C0402]  69.57,78.82 0 bottom
C139  1uF  [C0402]  69.57,77.04 180 bottom
C140  10pF  [C0402]  69.57,77.93 180 bottom
C141  DNP/18pF  [C0402]  64.59,78.16 270 bottom
C142  1.2pF  [C0402]  61.9,78.16 270 bottom
C143  18pF  [C0402]  74.3,79.3 180 bottom
C144  18pF  [C0402]  74.3,77.32 180 bottom
C145  18pF  [C0402]  71.04,76.43 270 bottom
C148  DNP/EECENOF204Rk  [2P-D6.8MMX1.8MMH]  7.98,91.77 270 top
C151  4.7uF  [C0805]  51.74,80.01 90 top
C152  4.7uF  [C0805]  57.43,77.27 90 top
C153  22uF  [C0805]  14.11,66.5 90 top
C154  22uF  [C0805]  12.19,61.85 180 bottom
C155  22uF  [C0805]  12.19,63.88 180 bottom
C156  SMD CAP Tantalum 47uF-10V;B  [AVX-B]  12.7,66.42 180 bottom
C157  4.7nF  [C0402]  14.1,68.64 0 top
C158  33nF  [C0402]  22.35,69.72 180 top
D1  SS0520-7-F  [SOD123]  16.59,86.59 180 top
D2  MMSZ4689-V  [SOD123-2.7X1.6]  17.53,66.42 0 bottom
D3  CESD5V0AP  [SOT23]  18.24,97.89 180 top
D4  CESD5V0AP  [SOT23]  15.11,97.92 180 top
D6  CESD5V0AP  [SOT23]  11.25,83.03 270 top
D7  SS14  [D2010]  20.45,64.01 180 top
D15  SS0520-7-F  [SOD123]  31.22,62.86 180 bottom
DN  USB_DP  [TP_4545]  6.6,82.04 0 top
DP  USB_DN  [TP_4545]  6.6,83.95 0 top
GPS  U-FL Connector  [4P-U-FL]  80.09,101.3 180 bottom
GSM  U-FL Connector  [4P-U-FL]  82.68,65.53 180 bottom
J1  SMD Grove;4P-2.0  [4P-SMD-2.0]  36.32,96.01 270 top
J2  JST  [JST-SMD-2.0-90D]  3.94,61.72 270 top
J4  TF+SIM-VSHO-21-3301  [16P-L17.4MM*W16.5MM*H2.7MM]  10.29,85.85 90 bottom
J7  Micro USB 5P without POST;ST-USB-001G  [MICRO-USB]  4.7,82.68 270 top
J11  SMD Grove;4P-2.0  [4P-SMD-2.0]  45.85,96.01 270 top
J16  344017001  [8P-3.5-SMD]  -0.38,101.09 0 top
JTAG  DNP  [2*5P-2.0-TESTPOINT]  16.64,99.82 180 bottom
L  GREEN  [LED-0603]  23.62,96.19 0 top
L1  4.3nH  [L0402]  51.44,68.81 0 bottom
L2  Bead 120R-2A  [L0603]  51.26,77.44 0 top
L3  LQM2MPN2R2MG0  [0806]  59.74,90.98 270 bottom
L4  4.3nH  [L0402]  43.7,78.02 90 bottom
L5  6.8nH  [L0402]  65.53,101.73 0 bottom
L6  LQM2MPN2R2MG0  [0806]  51.51,76.45 180 bottom
L7  1.5nH  [L0402]  63.25,78.61 0 bottom
L8  SMD Power Inductor 10uH-20%;021042001  [L0630]  26.92,65.41 270 top
L9  BLM15BD182SN1  [L0402]  18.19,88.7 0 top
L10  BLM15BD182SN1  [L0402]  15.14,88.82 180 top
L11  100nH  [L0603]  12.6,94.08 180 top
L12  1nH  [L0402]  42.24,76.56 180 bottom
L13  SMD Power Inductor 10uH-20%;021042001  [L0630]  21.41,75.21 90 top
L14  1.8nH  [L0402]  44.15,76.56 180 bottom
L15  4.7nH  [L0402]  44.59,79.79 270 bottom
L16  4.3nH  [L0402]  51.44,67.59 0 bottom
L17  4.3nH  [L0402]  41.61,70.15 0 bottom
L18  3.3nH  [L0402]  59.23,102.06 90 bottom
L19  4.3nH  [L0402]  41.55,68.96 0 bottom
L20  22nH  [L0603]  70.87,99.44 0 bottom
L21  BLM18BD252SN1  [L0603]  16.64,101.35 90 top
L22  BLM18BD252SN1  [L0603]  18.85,101.37 90 top
L23  BLM18BD252SN1  [L0603]  14.61,101.37 90 top
L24  470R-1000mA  [L0805]  12.2,66.5 90 top
P1  [ROUND-MARK-1.0]  1.68,107.67 0 top
P2  [ROUND-MARK-1.0]  80.19,58.7 0 top
P3  [ROUND-MARK-1.0]  1.68,107.67 0 bottom
P4  [ROUND-MARK-1.0]  80.19,58.7 0 bottom
P5  [ROUND-MARK-1.0]  2.67,113.16 0 top  (outside the outline)
P6  [ROUND-MARK-1.0]  2.67,-3.68 0 top  (outside the outline)
P7  [ROUND-MARK-1.0]  170.31,113.16 0 top  (outside the outline)
P8  [ROUND-MARK-1.0]  170.31,-3.68 0 top  (outside the outline)
P9  [ROUND-MARK-1.0]  2.67,-3.68 270 bottom  (outside the outline)
P10  [ROUND-MARK-1.0]  170.31,-3.68 270 bottom  (outside the outline)
P11  [ROUND-MARK-1.0]  170.31,113.16 270 bottom  (outside the outline)
P12  [ROUND-MARK-1.0]  2.67,113.16 270 bottom  (outside the outline)
PWR  GREEN  [LED-0603]  14.1,57.91 270 top
Q1  CJ2302  [SOT23]  7.75,61.09 270 bottom
Q2  CJ2302  [SOT23]  23.62,99.19 180 top
Q3  CJ2302  [SOT23]  29.34,91.59 270 bottom
Q4  CJ2302  [SOT23]  34.04,92.41 0 bottom
Q6  CJ2305  [SOT23]  29.97,99.19 180 top
Q7  CJ2305  [SOT23]  26.8,99.19 180 top
Q8  CJ2302  [SOT23]  37.34,99.11 0 bottom
Q9  CJ2302  [SOT23]  37.34,102.54 0 bottom
Q10  CJ2302  [SOT23]  37.34,95.55 0 bottom
Q11  CJ2302  [SOT23]  40.64,90.81 0 bottom
Q12  CJ2302  [SOT23]  40.64,102.54 0 bottom
Q13  CJ2302  [SOT23]  40.64,95.55 0 bottom
Q14  S8550  [SOT23]  3.3,64.26 270 bottom
R1  0R  [R0402]  60.43,69.06 180 bottom
R2  10K  [R0402]  21.74,84.56 0 bottom
R3  100K  [R0402]  54.43,76.53 270 bottom
R4  49.9R-1%  [R0402]  55.91,78.05 270 top
R5  910K  [R0402]  56.34,83.74 180 top
R6  10K  [R0402]  50.27,82.3 0 bottom
R7  1K  [R0402]  10.57,86.49 180 top
R8  1.5K  [R0402]  22.1,85.09 0 top
R10  100R  [R0402]  18.24,93.4 0 top
R11  100R  [R0402]  15.14,93.4 0 top
R12  1K  [R0402]  32.74,73.1 0 top
R13  1.5K  [R0402]  27.03,74.8 270 bottom
R14  1.5K  [R0402]  27.51,76.45 180 bottom
R15  470R  [R0402]  15.14,95.43 180 top
R16  470R  [R0402]  18.24,95.43 180 top
R17  0R  [R0402]  8.51,83.64 0 top
R18  0R  [R0402]  8.51,82.45 0 top
R19  10K  [R0402]  28.78,82.68 180 bottom
R20  10K  [R0402]  29.11,85.24 0 bottom
R21  0R  [R0402]  79.38,83.31 0 bottom
R22  0R  [R0402]  34.54,100.56 180 top
R23  0R  [R0402]  34.49,101.6 180 top
R24  10K  [R0402]  36.22,80.72 180 top
R25  0R  [R0402]  13.08,95.4 180 top
R26  DNP/0R  [R0402]  49.89,98.37 180 bottom
R27  0R  [R0402]  33.48,97.16 180 top
R28  0R  [R0402]  33.48,98.17 180 top
R29  100K  [R0402]  25.3,101.98 270 top
R30  3.9k  [R0402]  16.38,68.58 0 top
R31  DNP/0R  [R0402]  49.89,97.49 180 bottom
R32  0R  [R0402]  50.27,81.31 0 bottom
R33  10K  [R0402]  14.99,73.23 90 top
R34  33K-1%  [R0402]  12.52,72.76 0 top
R35  8.2K-1%  [R0402]  11,75.22 90 top
R36  1K  [R0402]  21.26,60.07 90 bottom
R37  DNP/10K  [R0402]  33.86,80.72 0 top
R38  0R  [R0402]  19.53,95.22 0 bottom
R39  100R  [R0402]  19.53,101.88 0 bottom
R40  1K  [R0402]  4.06,107.06 180 top
R41  0R  [R0402]  65.53,100.2 180 bottom
R45  33K-1%  [R0402]  43.03,62.31 0 bottom
R46  4.7K  [R0402]  39.5,98.93 90 bottom
R47  100R  [R0402]  18.21,60.07 270 bottom
R48  10R  [R0402]  14.22,78.46 90 top
R49  1K  [R0402]  22.73,101.98 90 top
R50  33K-1%  [R0402]  12.52,74.78 180 top
R51  0R  [R0402]  12.52,73.76 0 top
R52  0R  [R0402]  56.52,101.47 270 bottom
R53  100K  [R0402]  5.97,107.06 0 top
R54  0R  [R0402]  79.38,65.53 0 bottom
R55  0R  [R0402]  52.53,64.54 270 bottom
R56  24K  [R0402]  54.56,62.64 270 bottom
R57  10K  [R0402]  53.54,62.64 270 bottom
R58  33K-1%  [R0402]  48.51,63.63 180 bottom
R59  33K-1%  [R0402]  45.14,63.83 90 top
R60  0R  [R0402]  55.63,62.64 270 bottom
R61  0R  [R0402]  63.25,77.72 0 bottom
R62  68k  [R0402]  16.38,66.8 0 top
R63  100R  [R0402]  19.53,100.89 0 bottom
R64  100R  [R0402]  19.53,96.27 0 bottom
R65  100R  [R0402]  19.53,97.28 0 bottom
R66  100R  [R0402]  19.53,98.3 0 bottom
R67  DNP/1K  [R0402]  40.01,76.81 90 top
R68  100R  [R0402]  19.53,99.87 180 bottom
R69  10K  [R0402]  33.02,99.69 90 bottom
R70  330K  [R0402]  7.75,58.29 270 bottom
R71  4.7K  [R0402]  29.34,94.28 180 bottom
R72  10K  [R0402]  21.89,87.5 180 bottom
R73  4.7K  [R0402]  32.51,94.23 0 bottom
R74  10K  [R0402]  21.74,83.49 0 bottom
R75  10K  [R0402]  51.51,64.54 270 bottom
R76  1K  [R0402]  29.16,101.98 90 top
R77  1K  [R0402]  26.19,101.98 90 top
R78  1K  [R0402]  12.7,58.42 90 top
R79  0R  [R0402]  75.06,101.3 0 bottom
R80  DNP/0R  [R0402]  53.01,101.47 270 bottom
R81  1K  [R0402]  20.24,60.07 90 bottom
R82  4.7K  [R0402]  35.26,102.39 270 bottom
R83  4.7K  [R0402]  35.26,99.09 270 bottom
R84  10K  [R0402]  34.62,74.07 180 top
R85  10K  [R0402]  39.98,78.59 270 top
R86  39K  [R0402]  8.79,58.29 90 bottom
R87  10K  [R0402]  60.15,83.62 0 top
R88  33K-1%  [R0402]  45.14,61.9 270 top
R89  33K-1%  [R0402]  46.25,61.9 270 top
R90  33K-1%  [R0402]  47.37,61.9 270 top
R91  24K  [R0402]  16.38,67.69 0 top
R92  10K  [R0402]  60.15,84.51 0 top
R93  3.3K  [R0402]  6.98,63.63 180 bottom
R94  0.2R-0805-1%  [R0805]  7.75,65.53 0 bottom
R96  10K  [R0402]  35.2,78.59 270 top
R97  10K  [R0402]  34.26,78.59 270 top
R98  4.7K  [R0402]  31.88,91.64 270 bottom
R99  4.7K  [R0402]  36.96,91.57 180 bottom
R104  DNP/0R  [R0402]  35.99,70.48 270 bottom
R105  100R  [R0402]  34.62,73.1 180 top
R106  1K  [R0402]  30.86,101.98 90 top
R107  1K  [R0402]  27.69,101.98 90 top
R108  10K  [R0402]  24.41,101.98 270 top
R109  10K  [R0402]  49.89,96.6 180 bottom
R110  DNP/10K  [R0402]  53.9,101.47 270 bottom
R111  4.7K  [R0402]  34.06,102.44 270 bottom
R112  4.7K  [R0402]  36.96,93.14 0 bottom
R113  4.7K  [R0402]  35.1,95.5 270 bottom
R114  4.7K  [R0402]  40.64,88.39 0 bottom
R115  4.7K  [R0402]  41.5,98.98 270 bottom
R116  4.7K  [R0402]  44.88,102.57 270 bottom
R117  4.7K  [R0402]  42.8,102.54 270 bottom
R118  4.7K  [R0402]  40.64,93.14 0 bottom
R119  4.7K  [R0402]  43.87,102.54 270 bottom
RESET  SMD Button;TS-1188E 6C81  [4P-SMD-7X3.5X3.5H]  19.81,58.04 0 top
RST  RED  [LED-0603]  25.53,57.91 270 top
RX  RED  [LED-0603]  29.97,96.19 0 top
SW1  [3P-SMD-2CH-6.6X2.8-REINFORCE]  26.67,84.2 0 top
SW2  [3P-SMD-2CH-6.6X2.8-REINFORCE]  2.01,71.88 0 top
SW3  SWITCH-2CH-6P-2.54  [6P-2CH-2.54-7.6X3.0]  7.75,71.88 180 top
TX  RED  [LED-0603]  26.8,96.16 0 top
U1  MT5931  [TFBGA84]  56.01,82.3 180 bottom
U2  MT3332  [QFN48-6X6MM]  54.74,96.77 270 bottom
U3  MX25U12835FZNI10G  [WSON8-6X5X0.8H-W/HEAT]  35.69,83.85 270 bottom
U4  XC6221B332MR-G  [SOT-25J]  55.58,90.17 270 top
U6  BCT4699  [TQFN16]  29.34,92.2 0 top
U7  MT2502A  [VFBGA143]  35.94,76.33 90 bottom
U8  NC/STT818B  [SOT23-6L]  3.3,60.45 180 bottom
U9  B8313  [5P-SMD-1.4X1.1MM]  69.32,101.3 0 bottom
U10  [SHIELD-SMD-44.5X53.5]  23.62,104.9 180 bottom
U11  PCB  [ARDUINO-38P]  0.13,56.01 0 top
U12  MP1496  [TSOT23-8]  15.52,75.9 90 top
U13  MAX2659  [6P-SMD-1.5X1.0X0.72H]  63.55,101.22 180 bottom
U14  RF7198  [32P-SMD-RF1798-5.3MMX5.25MMX0.73H]  56.01,68.71 180 bottom
U15  FB2012-05N2R4GT  [8P-SMD-2X1.25X0.7H]  66.83,78.16 90 bottom
U16  uPG2176T5N  [TSON6]  71.88,78.31 0 bottom
U17  DNP/BAV70S  [SOT363]  45.57,63.14 90 bottom
U18  TXS0108PW  [TSSOP20]  28.6,99.16 0 bottom
U19  CJA1117B-3.3  [SOT89]  46.02,94.61 0 bottom
U20  ISL97516  [MSOP8]  20.45,67.44 270 top
U$13  [OSHW_FILLX200_NOTEXT]  74.42,66.17 90 top
U$14  [MTK-LINKLTONE]  30,81.94 0 top
U$15  [BYMTK-200-1]  74.42,79.5 90 top
U$18  [LOGO_SILK]  72.52,75.69 90 top
VBAT_TP  VBAT  [TP_4545]  14.71,63.63 0 bottom
VCHG_5V1  [TP_4545]  14.73,61.09 0 bottom
VIO_28  [TP_4545]  17.27,63.63 0 bottom
WI-FI/BT  U-FL Connector  [4P-U-FL]  82.68,83.31 180 bottom
X1  SMD Crystal 32.768KHZ-12.5pF-20ppm-80K  [2P-SMD-2.05X1.2]  29.51,78.33 270 bottom
X2  7L26002009  [2520]  63.63,96.65 90 bottom
X3  7M26000028/TXC  [4P-SMD-3.2X2.5]  43.18,73.61 0 bottom

## Tracks (layer width: path | path; a pad name or v marks a point on that pad's centre or on a via)
2G_ANT
  Bottom 0.132: U14.19 59.91,68.99 R1.1 59.97,69.08 C82.1
2G_XTAL1
  Bottom 0.102: 38.16,75.13 38.21,75.13 38.28,75.06 38.63,75.06 40.31,73.38 43.51,73.38 44.27,72.62
  Bottom 0.132: U7.B4 38.16,75.13
  Bottom 0.152: X3.1 44.3,72.59 44.27,72.62
2G_XTAL2
  Bottom 0.102: X3.3 41.91,73.86 41.63,73.58 40.36,73.58 38.68,75.26 38.41,75.26 U7.B5
  Bottom 0.132: U7.B5
5V_OUT  (via drill 0.3 pad 0.51)
  Top 0.61: J1.3 36.14,95.01 34.01,95.01 C28.1 C90.1 | 42.42,95.01 41.28,95.01 | v43.43,93.34 43.43,94.49 | 43.43,94.49 43.43,94.5 42.93,95.01 | 43.43,94.49 43.94,95 | v47.68,81 47.68,79.02 49.51,77.19 49.51,67.23 50.93,65.81 51.44,65.81 v51.49,65.86
  Top 0.813: J11.3 42.93,95.01 42.42,95.01 41.54,95.01 | 41.54,95.01 41.28,95.01 | 41.54,95.01 41.53,95.02 36.15,95.02 36.14,95.01
  Top 1.016: v11.23,67.69 11.53,67.39 L24.2
  GND 0.406: v11.3,60.58 11.43,60.58 11.56,60.45
  GND 0.61: v51.49,65.86 51.49,65.81 49.55,63.88 42.19,63.88 v41.58,64.49
  GND 1.016: v20.07,61.98 18.54,60.45 11.56,60.45 11.3,60.45
  Bottom 0.61: v43.43,93.34 43.56,93.34 43.82,93.09 44.45,93.09 44.45,92.91 44.37,92.84 U19.3 44.5,91.9 45.47,90.93 C1.1 45.33,90.64 C108.1 45.33,88.53 47.12,86.74 47.12,84.45 47.88,83.69 47.88,81.2 v47.68,81 | U11.28 36.83,59.94 36.83,64.11 37.21,64.49
  Bottom 1.016: v41.58,64.49 37.21,64.49 34.82,64.49 33.78,65.53 23.62,65.53 v20.07,61.98 | v11.3,60.58 C154.1 C155.1 11.3,66.36 C156.+ 11.24,67.68 v11.23,67.69
/M_SCL  (via drill 0.1 pad 0.25 layers 15-16, 0.2 pad 0.41 layers 2-15, 0.3 pad 0.51)
  GND 0.152: v37.31,90.6 38.58,89.33 38.58,82.37 39.01,81.94 v39.01,81.74
  GND1 0.076: U7.B11 38.14,78.38 38.38,78.61 38.88,78.61 39.26,78.99 39.26,80.15 39.42,80.31 39.42,81.33 v39.01,81.74
  Bottom 0.152: R99.2 37.31,91.48 v37.31,90.6 37.26,90.55 33.98,90.55 Q4.2
  other vias: 38.14,77.93
/M_SDA  (via drill 0.1 pad 0.25 layers 15-16, 0.2 pad 0.41 layers 2-15, 0.3 pad 0.51)
  Top 0.152: 44.2,87.07 37.59,87.07 36.8,86.28 35.28,86.28 31.93,89.64 31.93,89.99 31.42,90.5 v31.28,90.5 | 44.2,87.07 44.22,87.07 | 44.2,87.07 v44.37,87.25
  GND 0.102: v38.04,76.38 38.76,76.38 39.62,77.24 40.01,77.62 40.01,78.77 39.65,79.12 39.65,79.53 39.8,79.68 40.92,79.68
  GND 0.152: 40.92,79.68 42.29,81.05 42.29,85.17 v44.37,87.25
  GND1 0.152: v37.74,76.32 37.98,76.32 v38.04,76.38
  Bottom 0.152: U7.C7 v37.74,76.32 | R98.2 31.88,91.1 v31.28,90.5 30.56,90.5 Q3.2
/SPI_MISO  (via drill 0.3 pad 0.51)
  Top 0.152: U6.7 29.59,90.09 29.29,89.79 v29.18,89.79
  Bottom 0.152: v29.18,89.79 28.02,89.79 27.2,90.6 27.2,94.16 26.85,94.51 26.85,95.38 26.95,95.48 26.95,96.07 U18.8
/SPI_MOSI  (via drill 0.3 pad 0.51)
  Top 0.152: v27.36,94.97 27.91,94.41 28.97,94.41 29.08,94.3 U6.15
  Bottom 0.152: U18.7 27.62,95.24 v27.36,94.97
/SPI_SCL  (via drill 0.3 pad 0.51)
  Top 0.152: U6.3 26.93,91.95 v26.59,91.62 | v26.34,94.97 25.58,94.97 25.22,95.33 25.22,98.05 23.74,99.53 23.74,101.77 24.26,102.29 24.27,102.29 R108.1
  Bottom 0.152: v26.59,91.62 26.91,91.93 26.91,93.95 26.34,94.51 v26.34,94.97 26.34,96.08 U18.9
/SPI_SS  (via drill 0.3 pad 0.51)
  Top 0.152: v29.97,89.79 29.97,89.1 34.07,85.01 37.46,85.01 38.33,85.88 45.72,85.88 v46,86.16
  GND 0.152: v44.15,82.3 44.15,82.45 44.53,82.83 45.84,82.83 47.03,84.01 47.03,85.05 46,86.08 v46,86.16
  Bottom 0.076: 28.27,95.83 U18.6
  Bottom 0.102: U7.B13 38.99,79.58 41.98,79.58 42.9,80.49 42.9,80.75 | 43,82.02 43.31,82.32
  Bottom 0.152: 42.9,80.75 42.9,81.91 43.31,82.32 44.12,82.32 v44.15,82.3 | v29.97,89.79 29.9,89.79 29.44,90.25 28,90.25 27.51,90.74 27.51,94.21 27.86,94.56 27.86,95.07 28.27,95.48 28.27,95.83
ACCDET  (via drill 0.1 pad 0.25 layers 15-16, 0.2 pad 0.41 layers 2-15, 0.3 pad 0.51)
  GND 0.152: v33.15,74.91 33.06,74.82 31.58,74.82 31.27,74.5 30.5,74.5 28.93,76.07 v28.22,76.07
  GND1 0.076: v33.15,74.91 33.94,74.91 34.56,75.53 U7.K5
  GND1 0.102: U7.K5 34.89,75.53
  Bottom 0.152: R14.2 27.96,76.44 27.96,76.33 v28.22,76.07
  other vias: 34.94,75.53
AD0/D14
  Top 0.152: 45.12,61.45 R88.2 46.01,60.58 46.05,60.58 46.36,60.58 47.37,60.58 47.68,60.27 49.2,60.27 U11.19
AD1/D15
  Top 0.152: 46.24,61.45 R89.2 46.83,60.88 47.47,60.88 47.78,60.58 51.44,60.58 U11.20
AD2/D16
  Top 0.152: U11.21 53.67,60.88 47.94,60.88 R90.2
ANTSEL_0
  Bottom 0.152: U16.1 73.36,78.81 C143.1 73.85,84.95 70.14,88.66 60.28,88.66 57.1,85.47 57.1,84.7 U1.K8
ANTSEL_1  (via drill 0.3 pad 0.51)
  GND 0.152: v73.2,79.86 74.57,78.49 v74.57,76.43
  Bottom 0.076: U1.J8 57.51,84.3 57.51,84.71 57.4,84.81
  Bottom 0.152: U16.3 73.36,77.81 C144.1 73.81,77.28 73.81,76.68 74.07,76.43 v74.57,76.43 | 57.4,84.81 57.4,85.34 60.39,88.33 70.04,88.33 73.2,85.17 v73.2,79.86
APC_VBAIS  (via drill 0.1 pad 0.25 layers 15-16, 0.2 pad 0.41 layers 2-15, 0.3 pad 0.51)
  GND 0.203: v52.76,62.81 52.76,66.87 51.88,67.74 41.48,67.74 37.72,71.5 32.69,71.5 32.39,71.5 32.13,71.5 v32.11,71.53
  GND1 0.152: v32,76.33 31.37,76.33 31,75.96 31,72.63 v32.11,71.53
  Bottom 0.102: U7.N7 v32,76.33
  Bottom 0.152: R57.2
  Bottom 0.203: 53.33,62.19 R57.2 53.07,62.19 52.76,62.51 v52.76,62.81
AUDIO_GND  (via drill 0.3 pad 0.51)
  Top 0.305: 14.22,98.68 D4.2 14.35,99.06 14.35,99.09 12.64,97.37 v12.64,96.14 12.64,95.73 R25.2 12.61,95.38 | J16.2 5.32,97.6 | 5.41,97.55 J16.2 | J16.2 5.32,97.09 v6.17,96.24
  GND 0.305: v6.17,96.24 12.54,96.24 v12.64,96.14
AVDD_SMPS  (via drill 0.3 pad 0.51)
  Top 0.152: 54.48,78.16 C12.1
  Top 0.305: 54.48,78.16 v54.48,78.92
  Top 0.406: v52.6,78.92 52.1,78.92 51.89,79.12
  Top 0.61: C151.1 51.89,79.12 51.99,79.12 52.05,79.07 52.05,77.47 L2.2 53.52,77.44 54.13,78.05 54.38,78.05 C12.1
  Bottom 0.076: U1.A4 55.23,80.05 | 54.27,80.03 U1.A2
  Bottom 0.152: U1.A2 54.26,80.01
  Bottom 0.254: U1.A4 55.26,79.69 v54.48,78.92 | v52.6,78.92 53.11,78.92 54.24,80.05 U1.A2
BANDSW  (via drill 0.1 pad 0.25 layers 1-2, 0.1 pad 0.25 layers 15-16, 0.2 pad 0.41 layers 2-15, 0.3 pad 0.51)
  Top 0.152: v51.44,63.32 51.03,63.73 50.52,63.73 47.27,66.98 47.27,73.38 45.75,74.91 45.75,78.33 v45.8,78.38
  GND 0.102: v45.8,78.38 45.62,78.21 42.25,78.21 41.15,77.1 41.15,76.19 40.65,75.69 40.01,75.69 v39.79,75.47
  GND1 0.076: U7.D5 37.45,75.64 39.63,75.64 v39.79,75.47
  GND1 0.102: U7.D5 37.35,75.53
  Bottom 0.152: R60.2 55.63,62.03 54.88,61.28 53.02,61.28 51.44,62.86 v51.44,63.32
  other vias: 37.34,75.53
BAT_CHARGE
  Bottom 2.032: R94.1 8.64,66.93 SW3.CH2A
  pour Bottom (isolate 0.254, no thermals): 8,64.9 9.27,64.9 9.27,66.55 8,66.55
BATON  (via drill 0.1 pad 0.25 layers 1-2, 0.1 pad 0.25 layers 15-16, 0.2 pad 0.41 layers 2-15)
  Top 0.102: 35.08,74.05 R84.1
  Top 0.152: 35.08,74.05 35.52,74.05 v35.54,74.04
  GND 0.152: v35.54,74.04 35.59,74.04 v35.94,74.4
  GND1 0.102: v35.74,75.51 35.74,75.23 35.94,75.03 v35.94,74.4
  Bottom 0.102: U7.H5 v35.74,75.52 v35.74,75.51
BATTERY
  Top 0.254: 8.13,63.37 8.37,63.37 J2.+ 9.02,63.5
  Top 2.032: SW3.CH1A 8.38,68.45 8.38,63.39 8.37,63.37
  pour Top (isolate 0.254, no thermals): 7.24,62.61 7.24,64.01 arc-90 7.49,64.26 10.54,64.26 arc-90 10.79,64.01 10.79,62.61 arc-90 10.54,62.36 7.49,62.36 arc-90
BPI_BUS2  (via drill 0.3 pad 0.51)
  Top 0.406: R67.2 40.01,78 40.01,78.09 40.01,78.12 R85.2 39.82,78.14 v39.4,78.56
  Bottom 0.203: U7.A12 38.65,78.33 38.89,78.56 v39.4,78.56
BT_ANT
  Bottom 0.132: C111.1 L14.2 C110.1 46.04,76.56 arc-45 46.45,76.39 47.85,74.98 arc45 48.16,74.85 70.11,74.85 arc90 71.04,75.79 C145.2
BT_LNA
  Bottom 0.102: U7.A6 38.58,75.93
  Bottom 0.132: 41.77,76.53 L12.1 | L12.1 C114.1 | U7.A6 40.6,75.93 arc45 40.99,76.09 41.21,76.31 arc-45 L12.1
BUCK_VBAT
  Top 0.152: C78.2 13.01,72.8 R34.2
  Top 0.203: C78.2 14.08,71.59 C79.1
  Top 1.27: SW3.CH2B SW3.CH1B 10.79,72.9 10.79,72.25 11.74,71.3 C79.1 14.38,70.33 14.48,70.23 14.93,69.78 18.85,69.78 21.34,72.26 21.34,72.28 L13.1
CHR_LDO  (via drill 0.1 pad 0.25 layers 15-16, 0.3 pad 0.51)
  GND 0.152: v31.9,69.42 31.9,68.68 33,67.59 v33,67.13 | 9.65,61.59 v9.53,61.72 9.73,61.52 17.45,61.52 v17.65,61.72
  GND1 0.102: v33.5,72.31 34.07,72.31 35.54,73.78 35.54,74.52 35.64,74.62 v35.64,74.91
  Bottom 0.102: 36.11,75.48 36.11,75.53 U7.G5 36.14,75.51 35.64,75.01 v35.64,74.91
  Bottom 0.152: v33.5,72.31 33.5,71.6 31.9,70 v31.9,69.42 | v33,67.13 33,67.08 32.54,66.62 23.24,66.62 18.85,62.23 18.16,62.23 v17.65,61.72 | v9.53,61.72 9.02,61.72 Q1.1 8.57,62.17 C48.1 R93.2
CLDO  (via drill 0.3 pad 0.51)
  Top 0.152: 55.72,82.89 55.72,82.97 v55.65,83.03
  Top 0.305: C21.1 55.97,82.72 v55.65,83.03 55.23,83.45 54.49,83.45 54,82.96 C22.1 | v52.98,81.05 52.98,82.07 53.75,82.83 C22.1 | 53.98,82.8 C22.1
  Bottom 0.152: U1.G7 U1.G6 56.24,83.03 v55.65,83.03 55.27,83.03 U1.G4
  Bottom 0.254: U1.G4 56.73,83.05 56.74,83.03
  Bottom 0.305: U1.C1 v52.99,81.05 v52.98,81.05
CMCSD0  (via drill 0.3 pad 0.51)
  Top 0.152: U6.4 27.66,91.28 27.66,89.64 28.02,89.28 29.39,89.28 33.95,84.72 37.58,84.72 38.43,85.57 47.75,85.57 v47.9,85.72
  GND 0.152: v43.66,81.86 43.94,81.86 44.32,81.48 44.32,81.2 44.43,81.1 44.58,81.1 44.68,81.2 44.68,81.76 44.78,81.86 44.93,81.86 45.03,81.76 45.03,80.75 45.14,80.64 45.29,80.64 45.39,80.75 45.39,81.93 45.68,82.22 46.56,82.22 46.8,82.46 46.98,82.46 47.6,81.84 47.75,81.84 47.85,81.94 47.85,82.09 47.22,82.73 47.22,82.88 47.32,82.98 47.47,82.98 47.49,82.97 | 48,83.47 47.98,83.49 47.83,83.49 47.73,83.39 47.73,83.24 48.36,82.6 48.36,82.45 48.26,82.35 48.11,82.35 47.49,82.97 | 47.49,82.97 47.3,82.97 | 47.81,83.47 48,83.47 | 48,83.47 48.62,82.85 48.77,82.85 48.87,82.96 48.87,83.11 48.06,83.92 48.06,84.08 48.13,84.15 48.77,84.15 48.87,84.25 48.87,84.4 48.77,84.51 47.99,84.51 47.89,84.61 47.89,84.76 47.99,84.86 48.77,84.86 48.87,84.96 48.87,85.11 48.77,85.22 48.03,85.22 47.9,85.34 v47.9,85.72
  Bottom 0.102: U7.A13 39.19,79.38 42.05,79.38 43.21,80.53 43.21,80.75
  Bottom 0.152: 43.21,80.75 43.21,81.71 43.36,81.86 v43.66,81.86
CMCSD1  (via drill 0.1 pad 0.25 layers 15-16, 0.2 pad 0.41 layers 2-15, 0.3 pad 0.51)
  Top 0.152: U6.16 26.19,93.7 25.92,93.44 25.92,90.91 27.86,88.98 29.29,88.98 33.84,84.42 37.68,84.42 38.53,85.27 48.13,85.27 v48.57,85.7
  GND 0.076: v39.29,75.31 39.48,75.12 39.92,75.12 40.31,75.51 40.72,75.51 41.33,76.12 41.33,76.99 42.29,77.95 42.49,77.95
  GND 0.152: 42.49,77.95 47.42,77.95 v47.57,78.1
  GND1 0.076: U7.E5 36.94,75.45 37.21,75.18 37.39,75.18 37.67,75.46 39.14,75.46 v39.29,75.31
  GND1 0.102: U7.E5
  Bottom 0.152: v47.57,78.1 47.57,79.32 48.43,80.17 48.43,85.56 v48.57,85.7
  other vias: 36.94,75.53
CMMCLK  (via drill 0.1 pad 0.25 layers 15-16, 0.2 pad 0.41 layers 2-15, 0.3 pad 0.51)
  Top 0.152: U6.8 30.09,90.41 30.45,90.04 30.45,89.59 30.61,89.43 30.61,89.33 30.45,89.18 30.45,89.03 30.56,88.92 30.71,88.92 30.84,89.05 30.99,89.05 31.09,88.95 31.09,88.8 30.96,88.67 30.96,88.52 31.06,88.42 31.22,88.42 31.5,88.7 31.65,88.7 31.75,88.59 31.75,88.44 31.47,88.16 31.47,88.01 31.57,87.91 31.72,87.91 32,88.19 32.16,88.19 32.26,88.09 32.26,87.94 31.98,87.66 31.98,87.5 32.08,87.4 32.23,87.4 32.51,87.68 32.66,87.68 32.77,87.58 32.77,87.43 32.49,87.15 32.49,87 32.59,86.89 32.74,86.89 33.02,87.17 33.17,87.17 33.27,87.07 33.27,86.92 33,86.64 33,86.49 33.1,86.38 33.25,86.38 33.53,86.66 33.68,86.66 33.78,86.56 33.78,86.41 33.5,86.13 33.5,85.98 33.6,85.88 33.76,85.88 34.04,86.16 34.19,86.16 34.29,86.05 34.29,85.9 34.01,85.62 34.01,85.47 34.16,85.32 34.37,85.32 34.57,85.52 34.77,85.52 34.93,85.37 37.31,85.37 38.12,86.18 45.21,86.18 v45.36,86.33
  GND 0.152: v43.31,81 43.21,81.1 43.21,82.22 43.61,82.63 43.61,83.28 43.73,83.39 44.07,83.39 44.17,83.49 44.17,83.64 44.07,83.74 43.66,83.74 43.56,83.84 43.56,84.05 43.66,84.15 44.37,84.15 45.09,83.44 45.24,83.44 45.37,83.57 45.37,83.71 44.22,84.86 44.22,85.01 44.32,85.11 44.48,85.11 45.94,83.66 46.09,83.66 46.19,83.76 46.19,83.91 44.78,85.32 44.78,85.47 44.88,85.57 45.03,85.57 46.44,84.16 46.6,84.16 46.7,84.27 46.7,84.41 45.36,85.75 v45.36,86.33
  GND1 0.102: v43.31,81 42.03,81 40.92,79.89 40.92,77.65 v40.41,77.14
  Bottom 0.076: U7.B9 38.17,77.13 38.32,77.28 arc-45 38.61,77.39 38.72,77.39
  Bottom 0.102: 38.72,77.39 40.16,77.39 v40.41,77.14
CMRST/EINT15  (via drill 0.1 pad 0.25 layers 15-16, 0.2 pad 0.41 layers 2-15, 0.3 pad 0.51)
  GND 0.152: v38.56,78.28 38.56,78.38 38.05,78.89 38.05,80.62 38.43,81 38.85,81 39.45,81.59 39.45,82.63 39.19,82.88 39.19,90.6 38.33,91.47 37.62,91.47 37.01,92.07 37.01,93.73 34.1,96.65 30.5,96.65 v29.95,97.21
  GND1 0.152: 38.53,77.78 v38.39,77.63
  GND1 0.254: v38.56,78.28 38.56,77.8 v38.39,77.63
  Bottom 0.152: U7.B10 38.28,77.53 v38.39,77.63 | U18.3 30.2,96.12 30.2,96.95 v29.95,97.21
D8/GPIO48/EINT21
  Bottom 0.152: U11.9 41.78,103.56 | Q12.3 41.78,103.56 | R117.1 42.23,103.56 42.14,103.56 41.78,103.56
DRV  (via drill 0.3 pad 0.51)
  GND 0.152: v32.56,69.42 32.56,68.68 33.71,67.54 v33.71,67.13 | v9.63,59.97 10.87,61.21 17.91,61.21 v18.41,61.72
  Bottom 0.102: U7.J2 35.34,74.3 35.23,74.19 35.23,73.48 33.76,72.01 33.76,71.45 33.6,71.3 32.66,70.36
  Bottom 0.152: v33.71,67.13 32.84,66.27 23.34,66.27 18.8,61.72 v18.41,61.72 | v9.63,59.97 8.99,59.97 Q1.2 | v32.56,69.42 32.56,70.26 33.6,71.3
EAR_EINT  (via drill 0.1 pad 0.25 layers 15-16, 0.2 pad 0.41 layers 2-15, 0.3 pad 0.51)
  Top 0.152: v46.91,81.05 46.91,80.9 47.07,80.75 47.07,77.06 v47.57,76.56
  Top 0.305: R40.1 4.51,107.61 v4.5,107.62
  GND 0.102: v41.05,74.35 41.05,74.57 41.22,74.75 41.22,75.01 42.04,75.82 42.04,76.48 42.29,76.73 42.49,76.73
  GND 0.152: 42.49,76.73 47.4,76.73 v47.57,76.56 | v4.5,107.62 7.39,107.62 10.24,104.78 18.92,104.78 20.24,103.45 20.24,100.56 20.6,100.2 21.97,100.2 22.68,99.49 31.67,99.49 32.89,98.27 34.57,98.27 38.12,94.72 38.49,94.72 39.55,93.66 39.55,93.65 42.6,90.6 42.6,90.32 43.07,89.84 43.97,89.84 v44.53,90.4
  GND1 0.076: U7.A3 38.68,74.73 39.01,74.4 39.35,74.4 39.64,74.1 40.22,74.1 40.28,74.17 40.87,74.17 v41.05,74.35
  GND1 0.102: U7.A3 38.54,74.71
  Bottom 0.152: v46.91,81.05 47.37,81.51 47.37,83.39 43.71,87.05 43.71,89.59 v44.53,90.4
  other vias: 38.54,74.73
EINT_WIFI  (via drill 0.1 pad 0.25 layers 1-2, 0.1 pad 0.25 layers 15-16, 0.2 pad 0.41 layers 2-15, 0.3 pad 0.51)
  Top 0.152: v51.28,82.17 50.65,82.17 50.29,82.53 45.64,82.53 44.48,81.36 41.35,81.36 v40.56,80.57
  GND 0.152: 40.54,80.54 v40.26,80.54 40.54,80.54 v40.56,80.57
  GND1 0.076: v40.26,80.54 40.26,79.83 40.51,79.58 40.51,77.92 39.32,76.73 39.11,76.73 38.8,76.41 38.47,76.41 38.18,76.7 v37.74,76.7
  Bottom 0.076: U1.E2 54,81.79 53.54,81.79 53.47,81.86 53.06,81.86
  Bottom 0.102: v37.74,76.7 U7.C8
  Bottom 0.152: U1.E2 | R6.1 51.16,82.3 v51.28,82.17 51.59,81.86 53.06,81.86 | v37.74,76.7 U7.C8 v37.74,76.71
FB_OUT
  Top 0.305: R62.1 C4.1 15.63,65.61 C153.1
  Top 1.016: D7.- 17.53,63.25 15.08,63.25 C88.+ 14.99,63.63 14.11,64.5 C153.1 L24.1
FM_ANT_P-1  (via drill 0.3 pad 0.51)
  Top 0.305: R25.1 13.51,95.39 13.51,94.23 L11.1
  Top 0.406: 13.59,93.85 13.54,93.9 | 13.54,93.9 L11.1 | 13.54,93.9 13.54,93.27 v13.59,93.22
  Bottom 0.102: U7.F2 36.54,74.3 36.66,74.19 36.66,73.2
  Bottom 0.152: 36.66,73.2 36.66,73.08 35.99,72.41 R104.1 | R104.1 | R104.1 35.46,70.4 35.46,69.49
  Bottom 0.305: v13.59,93.22 13.13,92.76 13.13,86.38 13.75,85.77 13.75,74.73 18.76,69.72 28.73,69.72 30.18,68.27 34.74,68.27 35.46,68.99 35.46,69.49
FREF_26M_WIFI  (via drill 0.3 pad 0.51)
  GND 0.152: v56.34,76.12 56.34,73.86 v56.39,73.81
  Bottom 0.132: 46.86,74.55 45.94,75.47 arc45 45.6,75.62 41.44,75.62 arc45 41.16,75.5 41.11,75.45 arc-45 40.65,75.26 39.54,75.26 arc-45 39.21,75.4 arc45 38.89,75.53 U7.A5
  Bottom 0.152: 46.86,74.55 47.46,73.95 arc45 47.86,73.79 56.36,73.79 v56.39,73.81 | v56.34,76.12 56.86,76.12 C20.1
GND  (via drill 0.1 pad 0.25 layers 1-2, 0.1 pad 0.25 layers 15-16, 0.2 pad 0.41 layers 2-15, 0.3 pad 0.51)
  Top 0.132: 56.83,82.49 56.86,82.49 56.87,82.47
  Top 0.152: v51.89,82.42 51.69,82.42 51.28,82.83 41.63,82.83 41.43,82.63 v41.43,81.99 | RX.- 30.73,96.11 30.15,95.53 28.83,95.53 | 28.83,95.53 28.19,95.53 TX.- | C87.2 28.89,95.47 28.83,95.53 | v29.59,74.6 C97.2 30.31,75.02 30.61,75.31 32.21,75.31 32.59,75.69 33.53,75.69 34.04,75.18 | v33.45,78.16 33.3,78 32.84,78 31.88,78.97 31.37,78.97 | C96.2 30.31,77.51 v30.61,77.8 | J1.4 36.32,91.62 35.76,91.06 31.11,91.06 30.76,90.7 30.76,89.74 31.17,89.33 31.42,89.33 35.08,85.67 37.16,85.67 37.97,86.49 44.73,86.49 45.03,86.79 46.66,86.79 47.22,86.23 48.84,86.23 49.05,86.03 49.05,84.96 | 49.05,84.96 38.99,84.96 37.97,83.95 v35.15,83.95 33.91,83.95 29.21,88.65 23.65,88.65 v23.37,88.37 | 49.05,84.96 50.29,84.96 50.62,85.29 53.11,85.29 v53.37,85.55 | 53.59,80.43 53.84,80.19 C14.1 | U6.6 29.09,91.37 v29.34,91.62 | 31.37,78.97 26.16,78.97 v22.68,82.45 21.49,83.64 13.74,83.64 12.52,84.86 | C9.2 arc45 36.22,78.13 37.01,78.92 arc45 37.18,78.99 37.26,79.07 | v53.26,66.17 53.21,66.17 52.32,65.28 50.67,65.28 48.77,67.18 48.77,74.85 v47.8,75.82 | R84.2 34.16,74.07 | v44.58,71.6 44.58,72.87 43.31,74.14 43.31,78.51 v43.26,78.56 | v46.08,79.65 46.15,79.58 46.15,75.06 47.57,73.63 47.57,67.1 50.44,64.24 50.93,64.24 | Q2.2 22.73,100.46 23.37,101.09 23.37,101.98 23.62,102.23 | C10.2 31.38,78.98 31.37,78.97 | v16.64,96.95 16.64,95.5 16.13,95 16.13,92.46 16.51,92.07 16.64,92.07 | 16.64,92.07 16.76,92.07 17.14,92.46 17.14,93.76 C54.2 | 16.64,92.07 16.64,89.79 | 16.64,89.79 v16.66,89.76 | 16.64,89.79 16.64,88.9 16.51,88.77 16.51,87.63
  Top 0.203: 30.3,77.39 29.84,77.85 25.63,77.85 21.11,82.37 13.69,82.37 11.96,80.64 5.97,80.64 5.24,81.38 J7.5 | v36.88,75.46 37.33,75.46 C71.2 | C151.2 52.05,80.9 52.05,81.2 | C23.2 55.63,85.19 54.89,85.93 51.38,85.93 51.33,85.98 | 51.23,77.95 51.23,76.58 51.28,76.53 | v55.27,82.12 55.04,82.12 54.99,82.17 53.66,82.17 53.47,81.98 53.47,80.56 53.84,80.19 | v55.73,75.31 55.73,76.4 56.06,76.73 57.28,76.73 57.84,76.17 57.84,75.31
  Top 0.254: v24.27,78.63 24.13,78.49 24.13,77.37 24.46,77.04 v24.84,77.04 | 57.94,80.95 v57.23,80.95
  Top 0.305: 54.58,89.97 U4.2 | C54.2 R16.2 17.79,96.28 18.26,96.75 18.26,96.85 D3.3 | R15.2 14.69,96.48 D4.3 | v53.57,76.28 53.59,76.3 54.27,76.3 C12.2 54.43,76.33 54.74,76.33 | 56.86,82.49 56.86,82.64 55.89,83.6 R5.2 | v50.81,80.58 51.42,80.58 C151.2 | C152.1 57.23,76.38
  Top 0.406: 22.53,86.96 C107.- | 30.86,96.32 RX.- 30.89,96.34 v30.89,97.87 | C90.2 C28.2 33.03,95.39 v33.02,95.4 | v38.1,93.32 37.59,93.32 37.16,92.89 36.45,92.89 J1.4 | 54.27,76.3 54.27,75.35 v54.23,75.31 | U11.35 67.82,81.41 | U11.35 65.02,81.41 | U11.35 66.17,80.26 | U11.35 66.17,82.55 | v43.16,92.63 44.63,92.63 44.98,92.99 45.82,92.99 J11.4
  Top 0.61: J1.4 36.32,93.12 36.3,93.14 | 45.82,93.04 J11.4
  GND 0.152: v41.89,82.6 41.89,85.47 44.12,87.71 44.48,87.71 47.83,91.06 49.68,91.06 v50.93,92.3 | v29.9,76.17 28.27,77.8 28.27,83.03 27.96,83.34 27.96,87.37 27.33,88.01 26.34,88.01 23.2,84.87 12.92,84.87 9.58,88.21 9.58,93.9 9.17,94.31 8.71,94.31 8.32,93.92 6.87,93.92 v6.43,94.36 | 19.63,86.08 13.48,86.08 12.5,87.06 12.5,87.07 10.79,88.77 10.79,92.69 11.66,93.55 | 19.63,86.08 22.58,86.08 25.73,89.23 27.91,89.23 29.18,87.96 29.18,83.95 29.49,83.64 29.49,78.51 30.2,77.8 v30.61,77.8 | v39.88,76.33 39.88,75.95 | 39.7,75.87 39.8,75.87 39.85,75.92 40.51,75.92 40.87,76.28 40.87,77.09 v40.69,77.27 | v38.94,74.3 38.94,74.35 | 40.72,78.46 44.7,78.46 v44.88,78.64 | v3.96,98.65 3.96,100.66 5.63,102.34 15.62,102.34 15.82,102.13 17.3,102.13 | 3.94,102.69 4.5,103.25 16.99,103.25 17.25,103 17.25,102.18 17.3,102.13 | v3.91,102.67 3.91,103.94 4.39,104.42 9.37,104.42 9.83,103.96 17.45,103.96 18.52,102.89 18.52,102.44 18.21,102.13 17.3,102.13 | 51,62.25 53.34,62.25 v55.12,64.03 | 19.63,86.08 19.63,86.44 20.55,87.35 20.55,89.33 23.98,92.76 v25.48,92.76 | 51,62.25 v50.75,62.51 | 41.43,82.02 41.38,82.07 41.33,82.07 41.21,82.19 41.21,85.66 43.87,88.32 44.02,88.32 48.08,92.38 49.12,92.38 v49.15,92.35 | v45.01,79.65 43.33,79.65 42.8,80.19 | 51,62.25 40.23,62.25 39.12,63.37
  GND 0.203: v42.04,75.16 41.73,75.16 41.48,74.91 41.48,73.74 | v46.08,79.65 47.4,79.65 48.23,80.49 48.23,81.86 49.33,82.96 49.33,83.46 49.25,83.54
  GND 0.254: v38.93,75.87 39.7,75.87
  GND 0.305: v33.45,76.68 33.45,77.29 33.2,77.55 33.2,77.9 33.33,78.03 | 33.33,78.03 v33.45,78.16 | v33.55,74.57 33.59,74.57 U7.K6 v35.25,75.93 v35.26,75.92 | v52.17,66.22 52.17,66.8 51.64,67.33 39.95,67.33 | 34.87,77.8 34.65,78.03 v33.83,78.03 33.33,78.03 | v43.26,78.56 42.13,78.56 v41.68,78.12 | v36.93,71.02 31.75,71.02 31.72,70.99
  GND 0.406: v35.64,76.23 v36.16,76.23 v36.17,76.22 v36.17,75.74 36.17,75.34 v36.14,75.31
  GND1 0.076: 34.98,75.01 34.98,75.16 v35.33,75.51
  GND1 0.102: U7.F4 36.55,75.11 | U7.N9 33.74,76.97 v33.45,76.68 | 33.55,74.6 33.35,74.4 v33.35,74.35 33.35,74.37 v33.55,74.57 | 34.52,73.94 34.98,74.4 34.98,74.95 34.98,75.01 | v35.33,75.51
  GND1 0.152: v36.96,74.6 36.96,74.75 37.01,74.8 37.01,74.91 | v32.23,72.41 32.23,72.35 32.74,71.84
  GND1 0.203: U7.F4 | v35.33,75.51 35.33,75.97 35.43,76.07
  GND1 0.254: v39.8,76.66 39.8,76.4 v39.88,76.33 | 33.07,77.93 32.94,78.05 | 32.94,78.05 32.03,78.97 | 32.94,78.05 32.94,78 | 33,77.95 32.94,78 | 32.94,78 34.06,78 U7.M11 | v42.24,72.29 42.01,72.29 v41.81,72.49 41.5,72.8 v41.48,72.8 | v44.04,74.35 44.17,74.35 X3.4 44.7,74.88 v44.81,74.88 | v33.58,73.05 34.06,73.05 34.98,73.96 34.98,74.95
  GND1 0.305: U7.M11 | U7.M11
  GND1 0.508: 37.77,74.02 36.37,75.41 36.37,76.02 v36.17,76.22
  Bottom 0.076: U1.B3 55.01,80.29 55.01,79.9 54.74,79.63 | U1.J9 58.01,84.3 58.5,84.3 58.55,84.35 58.55,84.4 58.6,84.45